# EAGLE schematic Shutdown_2019_v1.0 (EAGLE 9.1.2)

## Sheet 1 of 10: uController
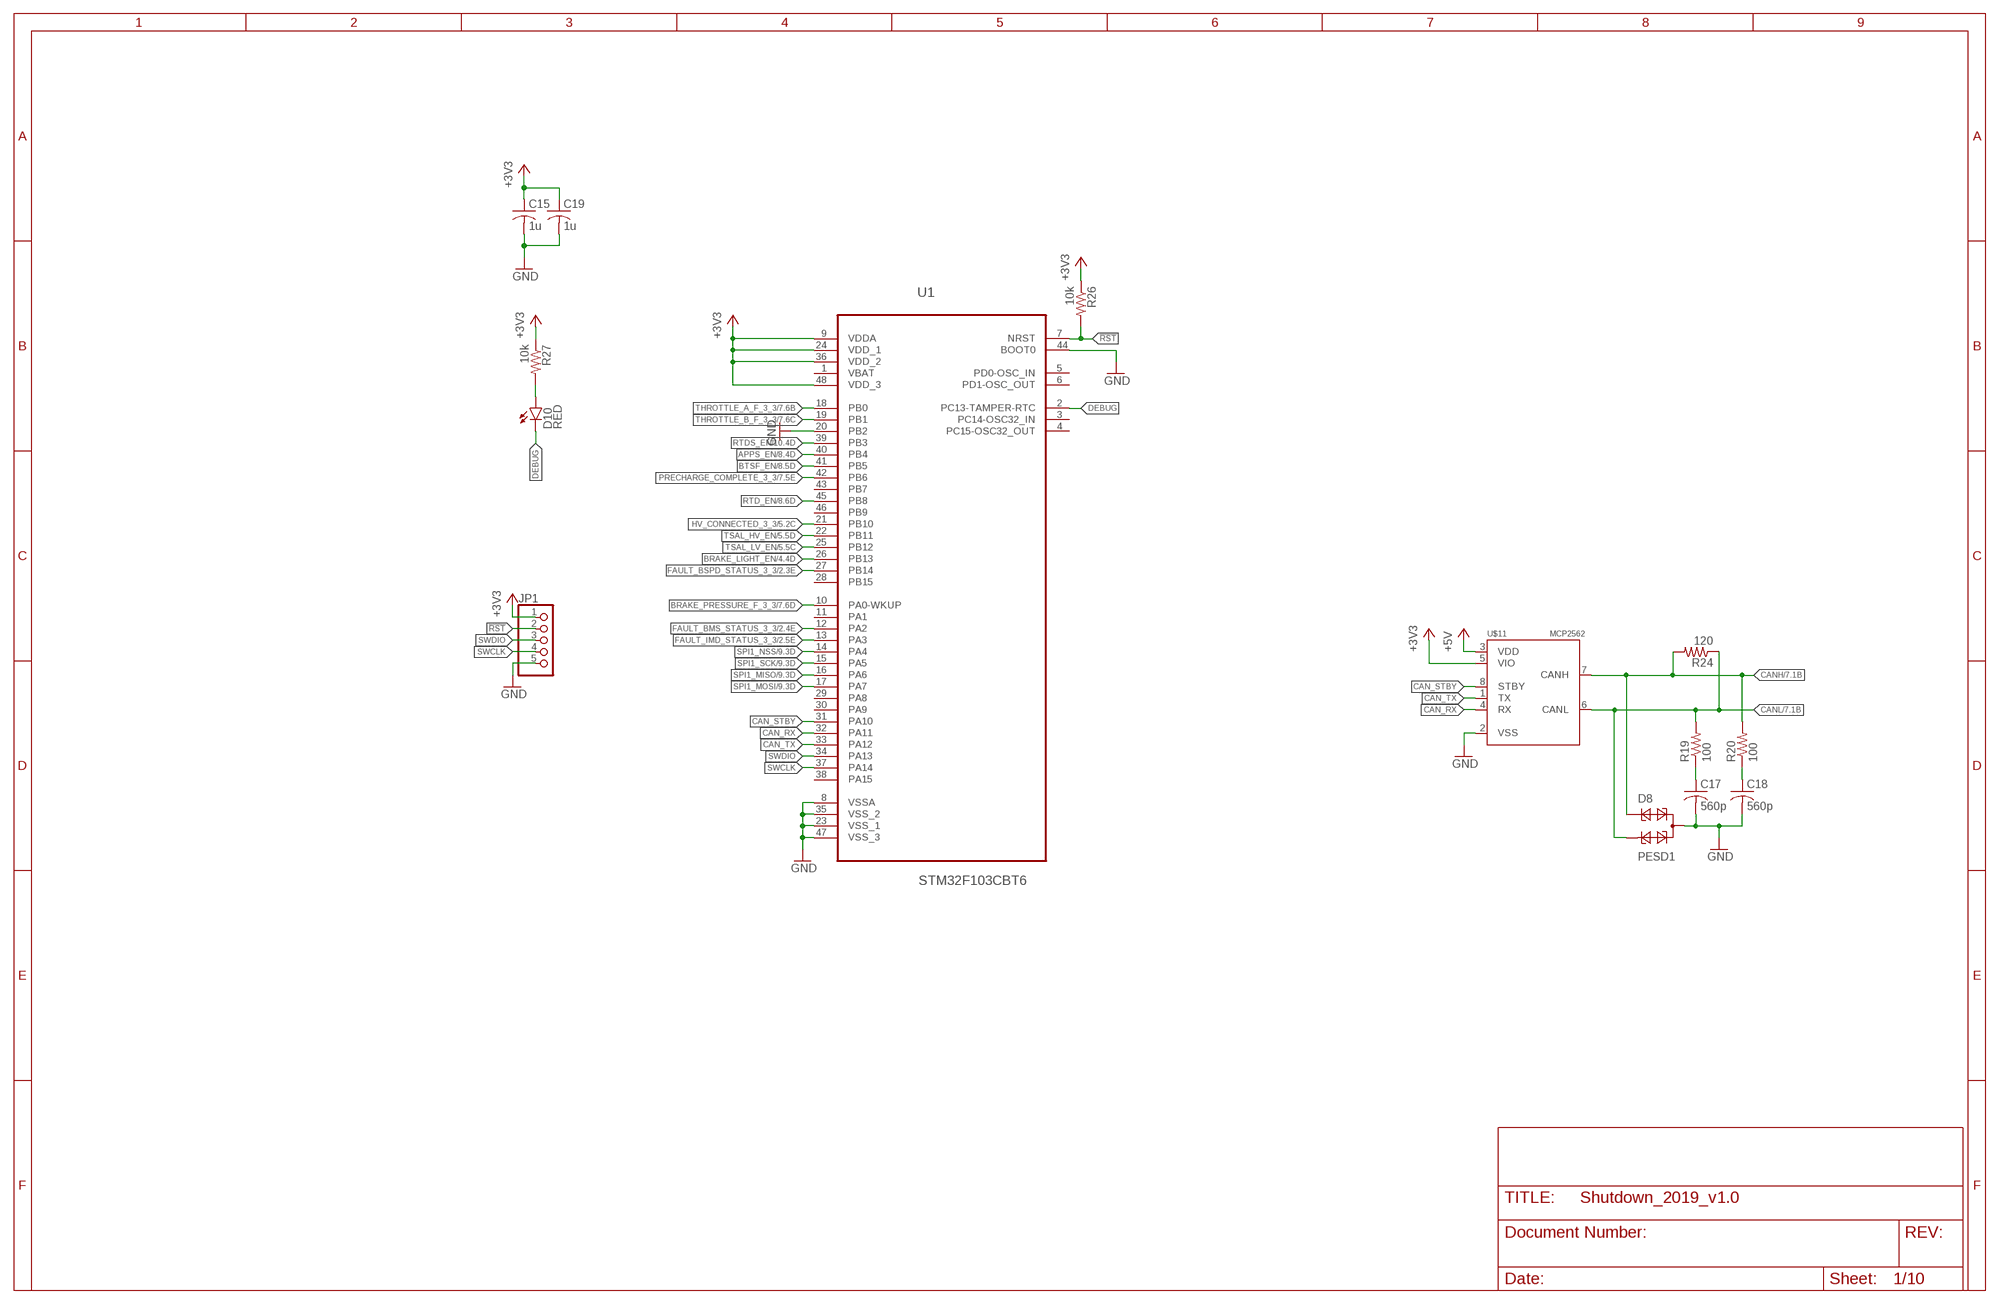
[diagram p0: schematic, sheet 1]

### Parts
C15  1u  C-USC0805  [C0805]
C17  560p  C-USC0603  [C0603]
C18  560p  C-USC0603  [C0603]
C19  1u  C-USC0805  [C0805]
D8  PESD1  PESD1CAN  [SOT23]
D10  RED  LED-RED0603  [LED-0603]
JP1  PINHD-1X5  [1X05]
R19  100  R-US_R0603  [R0603]
R20  100  R-US_R0603  [R0603]
R24  120  R-US_R0603  [R0603]
R26  10k  R-US_R0603  [R0603]
R27  10k  R-US_R0603  [R0603]
U1  STM32F103CBT6  [QFP50P900X900X160-48N]
U$11  MCP2562  [SOIC8]

### Nets
!RST: JP1.2 R26.2 U1.7(NRST)
+3V3 [PWR]: C15.1 C19.1 JP1.1 R26.1 R27.1 U1.9(VDDA) U1.24(VDD_1) U1.36(VDD_2) U1.48(VDD_3) U$11.5(VIO) ; also sheet 2,5,6,7,9
+5V [PWR]: U$11.3(VDD) ; also sheet 3,6,7,9
APPS_EN: U1.40(PB4) ; also sheet 8
BRAKE_LIGHT_EN: U1.26(PB13) ; also sheet 4
BRAKE_PRESSURE_F_3_3: U1.10(PA0-WKUP) ; also sheet 7
BTSF_EN: U1.41(PB5) ; also sheet 8
CAN_RX: U1.32(PA11) U$11.4(RX)
CAN_STBY: U1.31(PA10) U$11.8(STBY)
CAN_TX: U1.33(PA12) U$11.1(TX)
CANH: D8.1 R20.2 R24.2 U$11.7(CANH) ; also sheet 7
CANL: D8.2 R19.2 R24.1 U$11.6(CANL) ; also sheet 7
DEBUG: D10.C U1.2(PC13-TAMPER-RTC)
FAULT_BMS_STATUS_3_3: U1.12(PA2) ; also sheet 2
FAULT_BSPD_STATUS_3_3: U1.27(PB14) ; also sheet 2
FAULT_IMD_STATUS_3_3: U1.13(PA3) ; also sheet 2
GND: C15.2 C17.2 C18.2 C19.2 D8.3 JP1.5 U1.8(VSSA) U1.20(PB2) U1.23(VSS_1) U1.35(VSS_2) U1.44(BOOT0) U1.47(VSS_3) U$11.2(VSS) ; also sheet 2,3,4,5,6,7,8,9,10
HV_CONNECTED_3_3: U1.21(PB10) ; also sheet 5
N$14: C17.1 R19.1
N$17: C18.1 R20.1
N$19: D10.A R27.2
PRECHARGE_COMPLETE_3_3: U1.42(PB6) ; also sheet 7
RTD_EN: U1.45(PB8) ; also sheet 8
RTDS_EN: U1.39(PB3) ; also sheet 10
SPI1_MISO: U1.16(PA6) ; also sheet 9
SPI1_MOSI: U1.17(PA7) ; also sheet 9
SPI1_NSS: U1.14(PA4) ; also sheet 9
SPI1_SCK: U1.15(PA5) ; also sheet 9
SWCLK: JP1.4 U1.37(PA14)
SWDIO: JP1.3 U1.34(PA13)
THROTTLE_A_F_3_3: U1.18(PB0) ; also sheet 7
THROTTLE_B_F_3_3: U1.19(PB1) ; also sheet 7
TSAL_HV_EN: U1.22(PB11) ; also sheet 5
TSAL_LV_EN: U1.25(PB12) ; also sheet 5
Unconnected: U1.1(VBAT) U1.3(PC14-OSC32_IN) U1.4(PC15-OSC32_OUT) U1.5(PD0-OSC_IN) U1.6(PD1-OSC_OUT) U1.11(PA1) U1.28(PB15) U1.29(PA8) U1.30(PA9) U1.38(PA15) U1.43(PB7) U1.46(PB9)

## Sheet 2 of 10: Faults
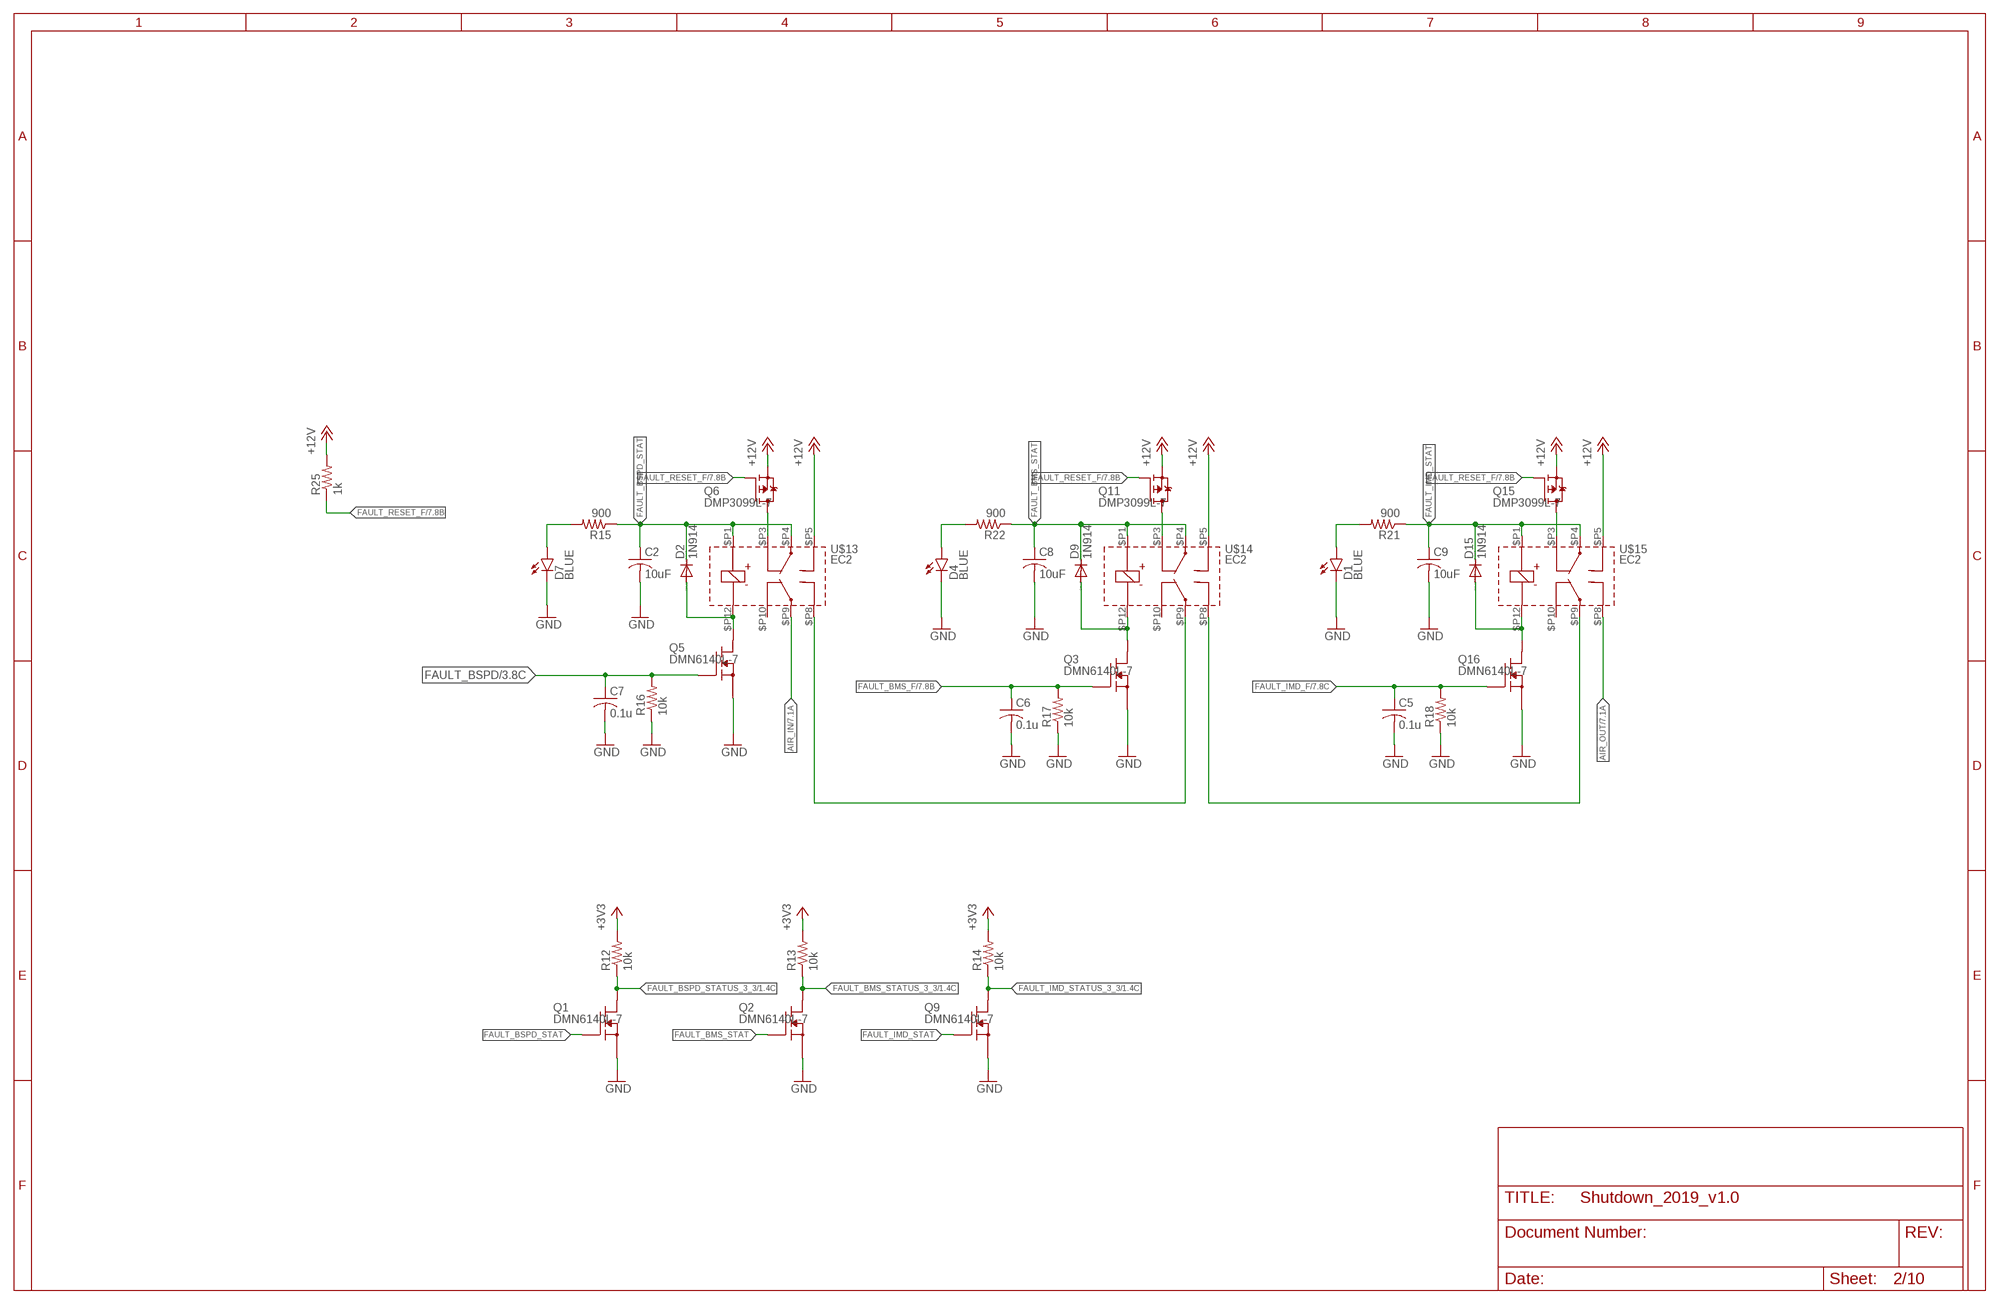
[diagram p1: schematic, sheet 2]

### Parts
C2  10uF  C-USC0805  [C0805]
C5  0.1u  C-USC0603  [C0603]
C6  0.1u  C-USC0603  [C0603]
C7  0.1u  C-USC0603  [C0603]
C8  10uF  C-USC0805  [C0805]
C9  10uF  C-USC0805  [C0805]
D1  BLUE  LED-BLUE0603  [LED-0603]
D2  1N914  [SOD323-F]
D4  BLUE  LED-BLUE0603  [LED-0603]
D7  BLUE  LED-BLUE0603  [LED-0603]
D9  1N914  [SOD323-F]
D15  1N914  [SOD323-F]
Q1  DMN6140L-7  [SOT23]
Q2  DMN6140L-7  [SOT23]
Q3  DMN6140L-7  [SOT23]
Q5  DMN6140L-7  [SOT23]
Q6  DMP3099L-7  [SOT23]
Q9  DMN6140L-7  [SOT23]
Q11  DMP3099L-7  [SOT23]
Q15  DMP3099L-7  [SOT23]
Q16  DMN6140L-7  [SOT23]
R12  10k  R-US_R0603  [R0603]
R13  10k  R-US_R0603  [R0603]
R14  10k  R-US_R0603  [R0603]
R15  900  R-US_R0603  [R0603]
R16  10k  R-US_R0603  [R0603]
R17  10k  R-US_R0603  [R0603]
R18  10k  R-US_R0603  [R0603]
R21  900  R-US_R0603  [R0603]
R22  900  R-US_R0603  [R0603]
R25  1k  R-US_R0603  [R0603]
U$13  EC2  [DPDT_2.54]
U$14  EC2  [DPDT_2.54]
U$15  EC2  [DPDT_2.54]

### Nets
+3V3 [PWR]: R12.2 R13.2 R14.2 ; also sheet 1,5,6,7,9
+12V [PWR_IN]: Q6.2(S) Q11.2(S) Q15.2(S) R25.2 U$13.$P5 U$14.$P5 U$15.$P5 ; also sheet 3,6
AIR_IN: U$13.$P9 ; also sheet 7
AIR_OUT: U$15.$P8 ; also sheet 7
FAULT_BMS_F: C6.1 Q3.1(G) R17.2 ; also sheet 7
FAULT_BMS_STAT: C8.1 D9.C Q2.1(G) R22.1 U$14.$P1 U$14.$P4
FAULT_BMS_STATUS_3_3: Q2.3(D) R13.1 ; also sheet 1
FAULT_BSPD: C7.1 Q5.1(G) R16.2 ; also sheet 3
FAULT_BSPD_STAT: C2.1 D2.C Q1.1(G) R15.1 U$13.$P1 U$13.$P4
FAULT_BSPD_STATUS_3_3: Q1.3(D) R12.1 ; also sheet 1
FAULT_IMD_F: C5.1 Q16.1(G) R18.2 ; also sheet 7
FAULT_IMD_STAT: C9.1 D15.C Q9.1(G) R21.1 U$15.$P1 U$15.$P4
FAULT_IMD_STATUS_3_3: Q9.3(D) R14.1 ; also sheet 1
FAULT_RESET_F: Q6.1(G) Q11.1(G) Q15.1(G) R25.1 ; also sheet 7
GND: C2.2 C5.2 C6.2 C7.2 C8.2 C9.2 D1.C D4.C D7.C Q1.2(S) Q2.2(S) Q3.2(S) Q5.2(S) Q9.2(S) Q16.2(S) R16.1 R17.1 R18.1 ; also sheet 1,3,4,5,6,7,8,9,10
N$1: D9.A Q3.3(D) U$14.$P12
N$8: D7.A R15.2
N$27: U$13.$P8 U$14.$P9
N$28: Q6.3(D) U$13.$P3
N$31: U$14.$P8 U$15.$P9
N$32: D2.A Q5.3(D) U$13.$P12
N$34: D4.A R22.2
N$35: Q11.3(D) U$14.$P3
N$42: D1.A R21.2
N$43: Q15.3(D) U$15.$P3
N$44: D15.A Q16.3(D) U$15.$P12
Unconnected: U$13.$P10 U$14.$P10 U$15.$P10

## Sheet 3 of 10: BSPD
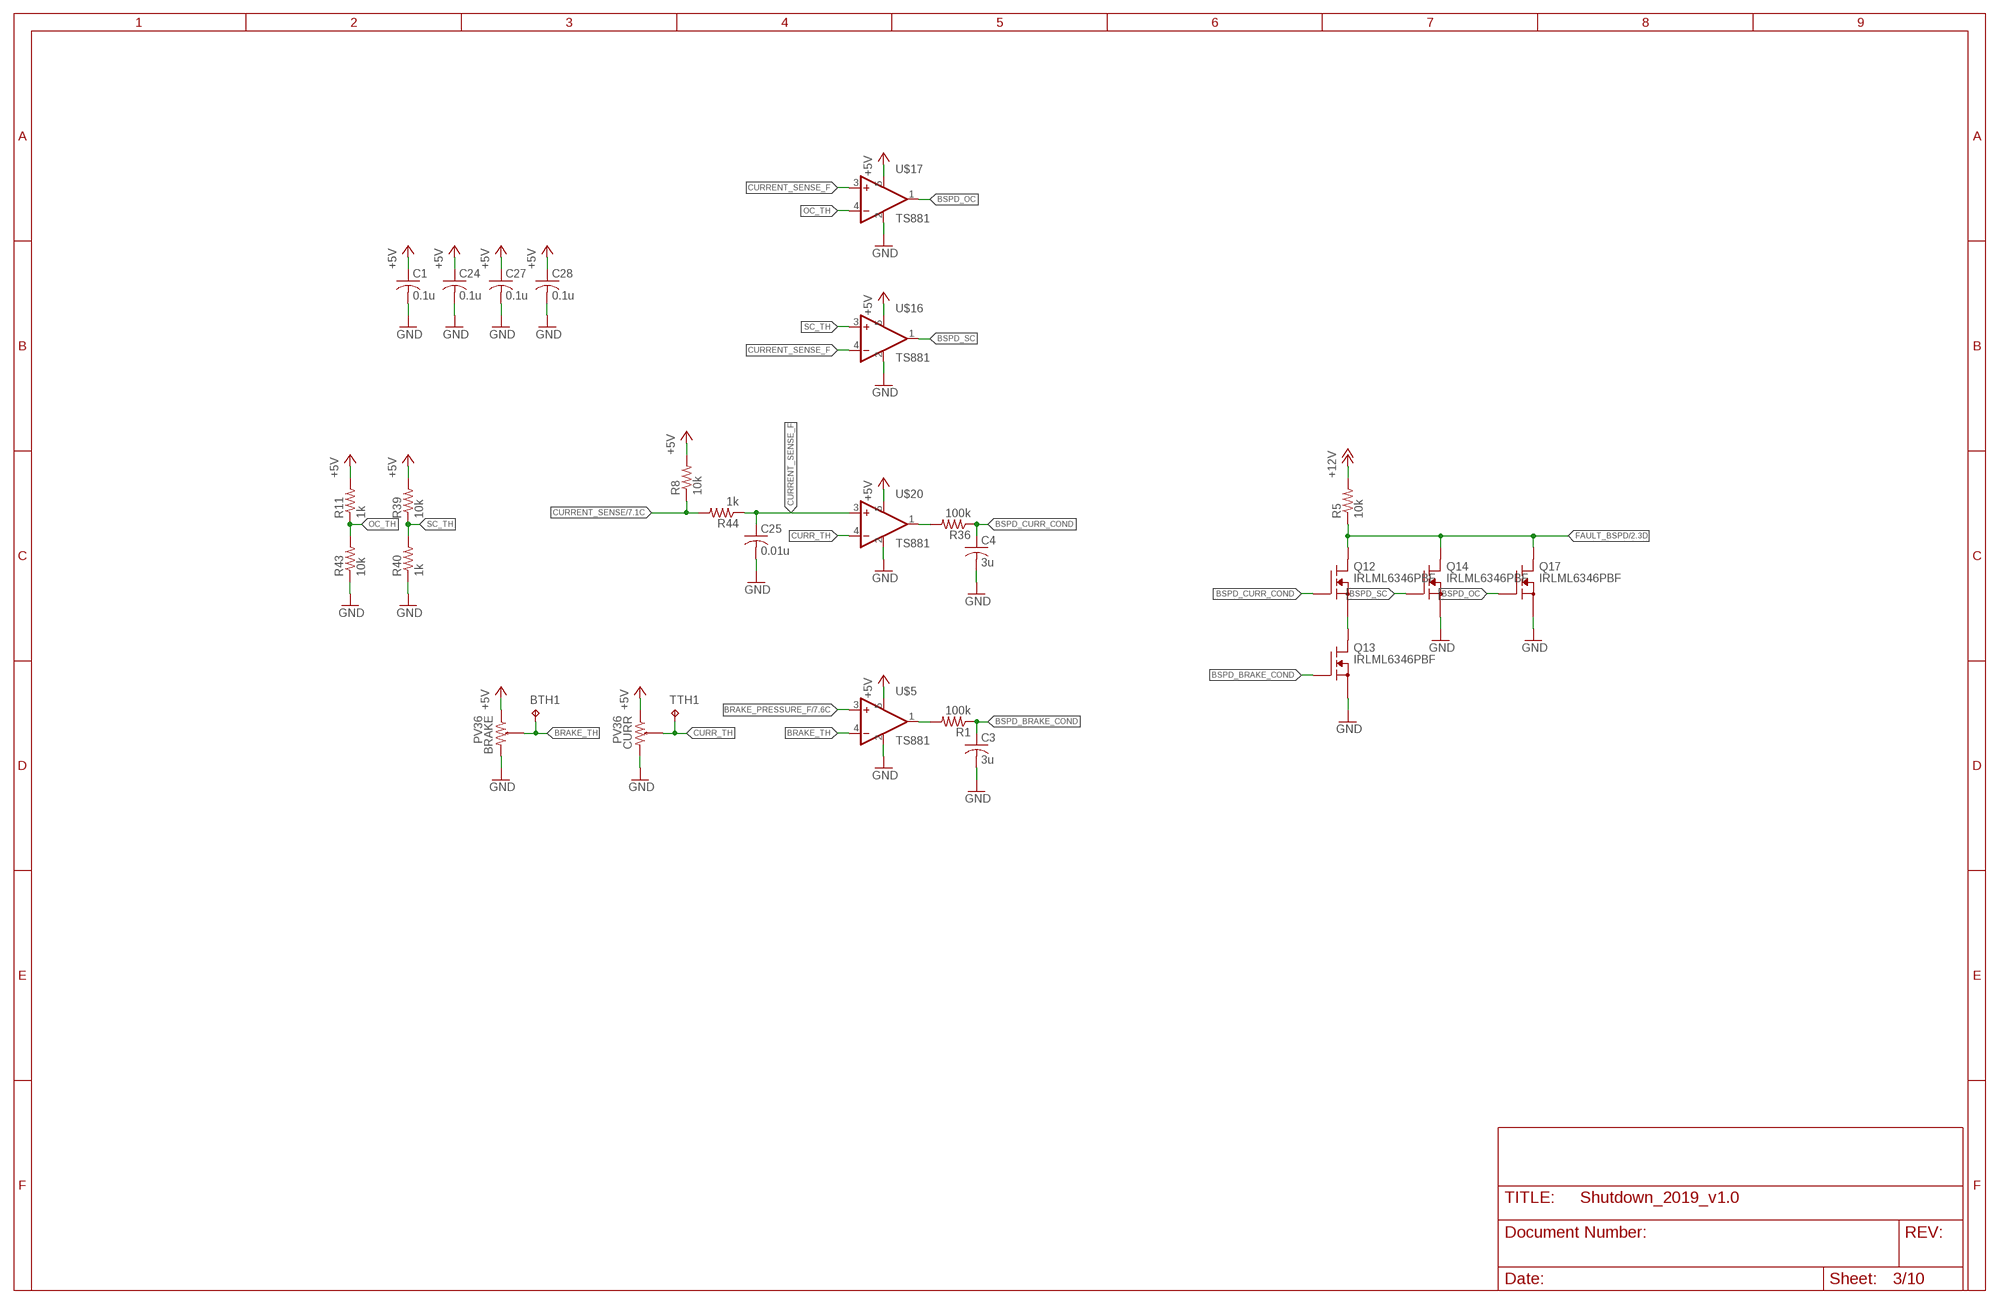
[diagram p2: schematic, sheet 3]

### Parts
BRAKE  PV36  [PV36]
BTH1  TPTP09R  [TP09R]
C1  0.1u  C-USC0603  [C0603]
C3  3u  C-USC0603  [C0603]
C4  3u  C-USC0603  [C0603]
C24  0.1u  C-USC0603  [C0603]
C25  0.01u  C-USC0603  [C0603]
C27  0.1u  C-USC0603  [C0603]
C28  0.1u  C-USC0603  [C0603]
CURR  PV36  [PV36]
Q12  IRLML6346PBF  [SOT23]
Q13  IRLML6346PBF  [SOT23]
Q14  IRLML6346PBF  [SOT23]
Q17  IRLML6346PBF  [SOT23]
R1  100k  R-US_R0603  [R0603]
R5  10k  R-US_R0603  [R0603]
R8  10k  R-US_R0603  [R0603]
R11  1k  R-US_R0603  [R0603]
R36  100k  R-US_R0603  [R0603]
R39  10k  R-US_R0603  [R0603]
R40  1k  R-US_R0603  [R0603]
R43  10k  R-US_R0603  [R0603]
R44  1k  R-US_R0603  [R0603]
TTH1  TPTP09R  [TP09R]
U$5  TS881  [SOT23-5]
U$16  TS881  [SOT23-5]
U$17  TS881  [SOT23-5]
U$20  TS881  [SOT23-5]

### Nets
+5V [PWR]: BRAKE.A C1.1 C24.1 C27.1 C28.1 CURR.A R8.2 R11.2 R39.2 U$5.5(VDD) U$16.5(VDD) U$17.5(VDD) U$20.5(VDD) ; also sheet 1,6,7,9
+12V [PWR_IN]: R5.2 ; also sheet 2,6
BRAKE_PRESSURE_F: U$5.3(+IN) ; also sheet 7
BRAKE_TH: BRAKE.W BTH1.TP U$5.4(-IN)
BSPD_BRAKE_COND: C3.1 Q13.1(G) R1.1
BSPD_CURR_COND: C4.1 Q12.1(G) R36.1
BSPD_OC: Q17.1(G) U$17.1(OUT)
BSPD_SC: Q14.1(G) U$16.1(OUT)
CURR_TH: CURR.W TTH1.TP U$20.4(-IN)
CURRENT_SENSE: R8.1 R44.2 ; also sheet 7
CURRENT_SENSE_F: C25.1 R44.1 U$16.4(-IN) U$17.3(+IN) U$20.3(+IN)
FAULT_BSPD: Q12.3(D) Q14.3(D) Q17.3(D) R5.1 ; also sheet 2
GND: BRAKE.B C1.2 C3.2 C4.2 C24.2 C25.2 C27.2 C28.2 CURR.B Q13.2(S) Q14.2(S) Q17.2(S) R40.1 R43.1 U$5.2(GND) U$16.2(GND) U$17.2(GND) U$20.2(GND) ; also sheet 1,2,4,5,6,7,8,9,10
N$9: Q12.2(S) Q13.3(D)
N$13: R36.2 U$20.1(OUT)
N$18: R1.2 U$5.1(OUT)
OC_TH: R11.1 R43.2 U$17.4(-IN)
SC_TH: R39.1 R40.2 U$16.3(+IN)

## Sheet 4 of 10: Brake Light
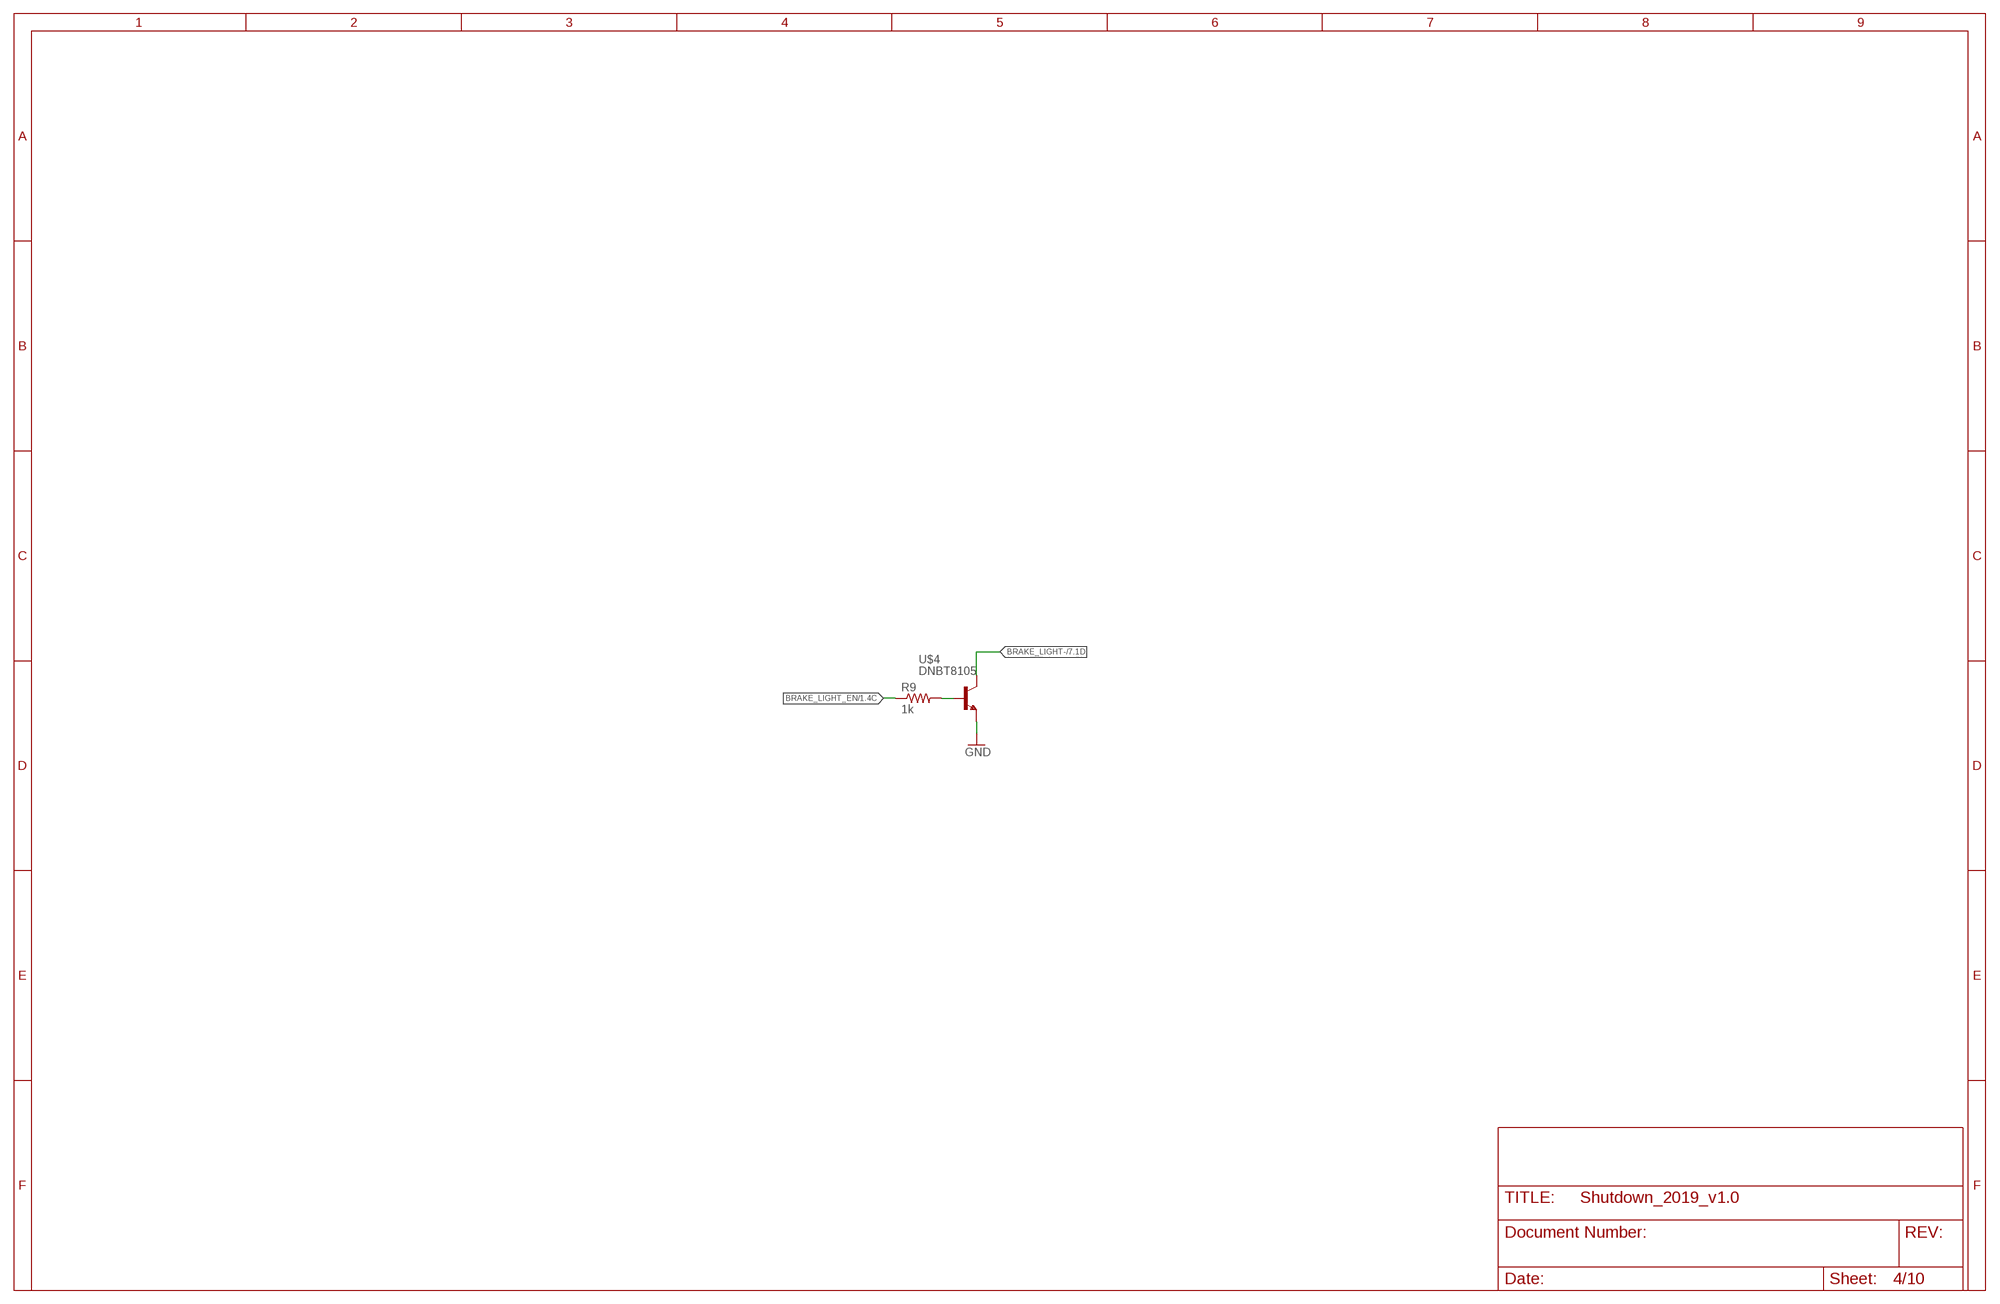
[diagram p3: schematic, sheet 4]

### Parts
R9  1k  R-US_R0603  [R0603]
U$4  DNBT8105  [SOT23-3]

### Nets
BRAKE_LIGHT-: U$4.3(C) ; also sheet 7
BRAKE_LIGHT_EN: R9.1 ; also sheet 1
GND: U$4.2(E) ; also sheet 1,2,3,5,6,7,8,9,10
N$3: R9.2 U$4.1(B)

## Sheet 5 of 10: TSAL
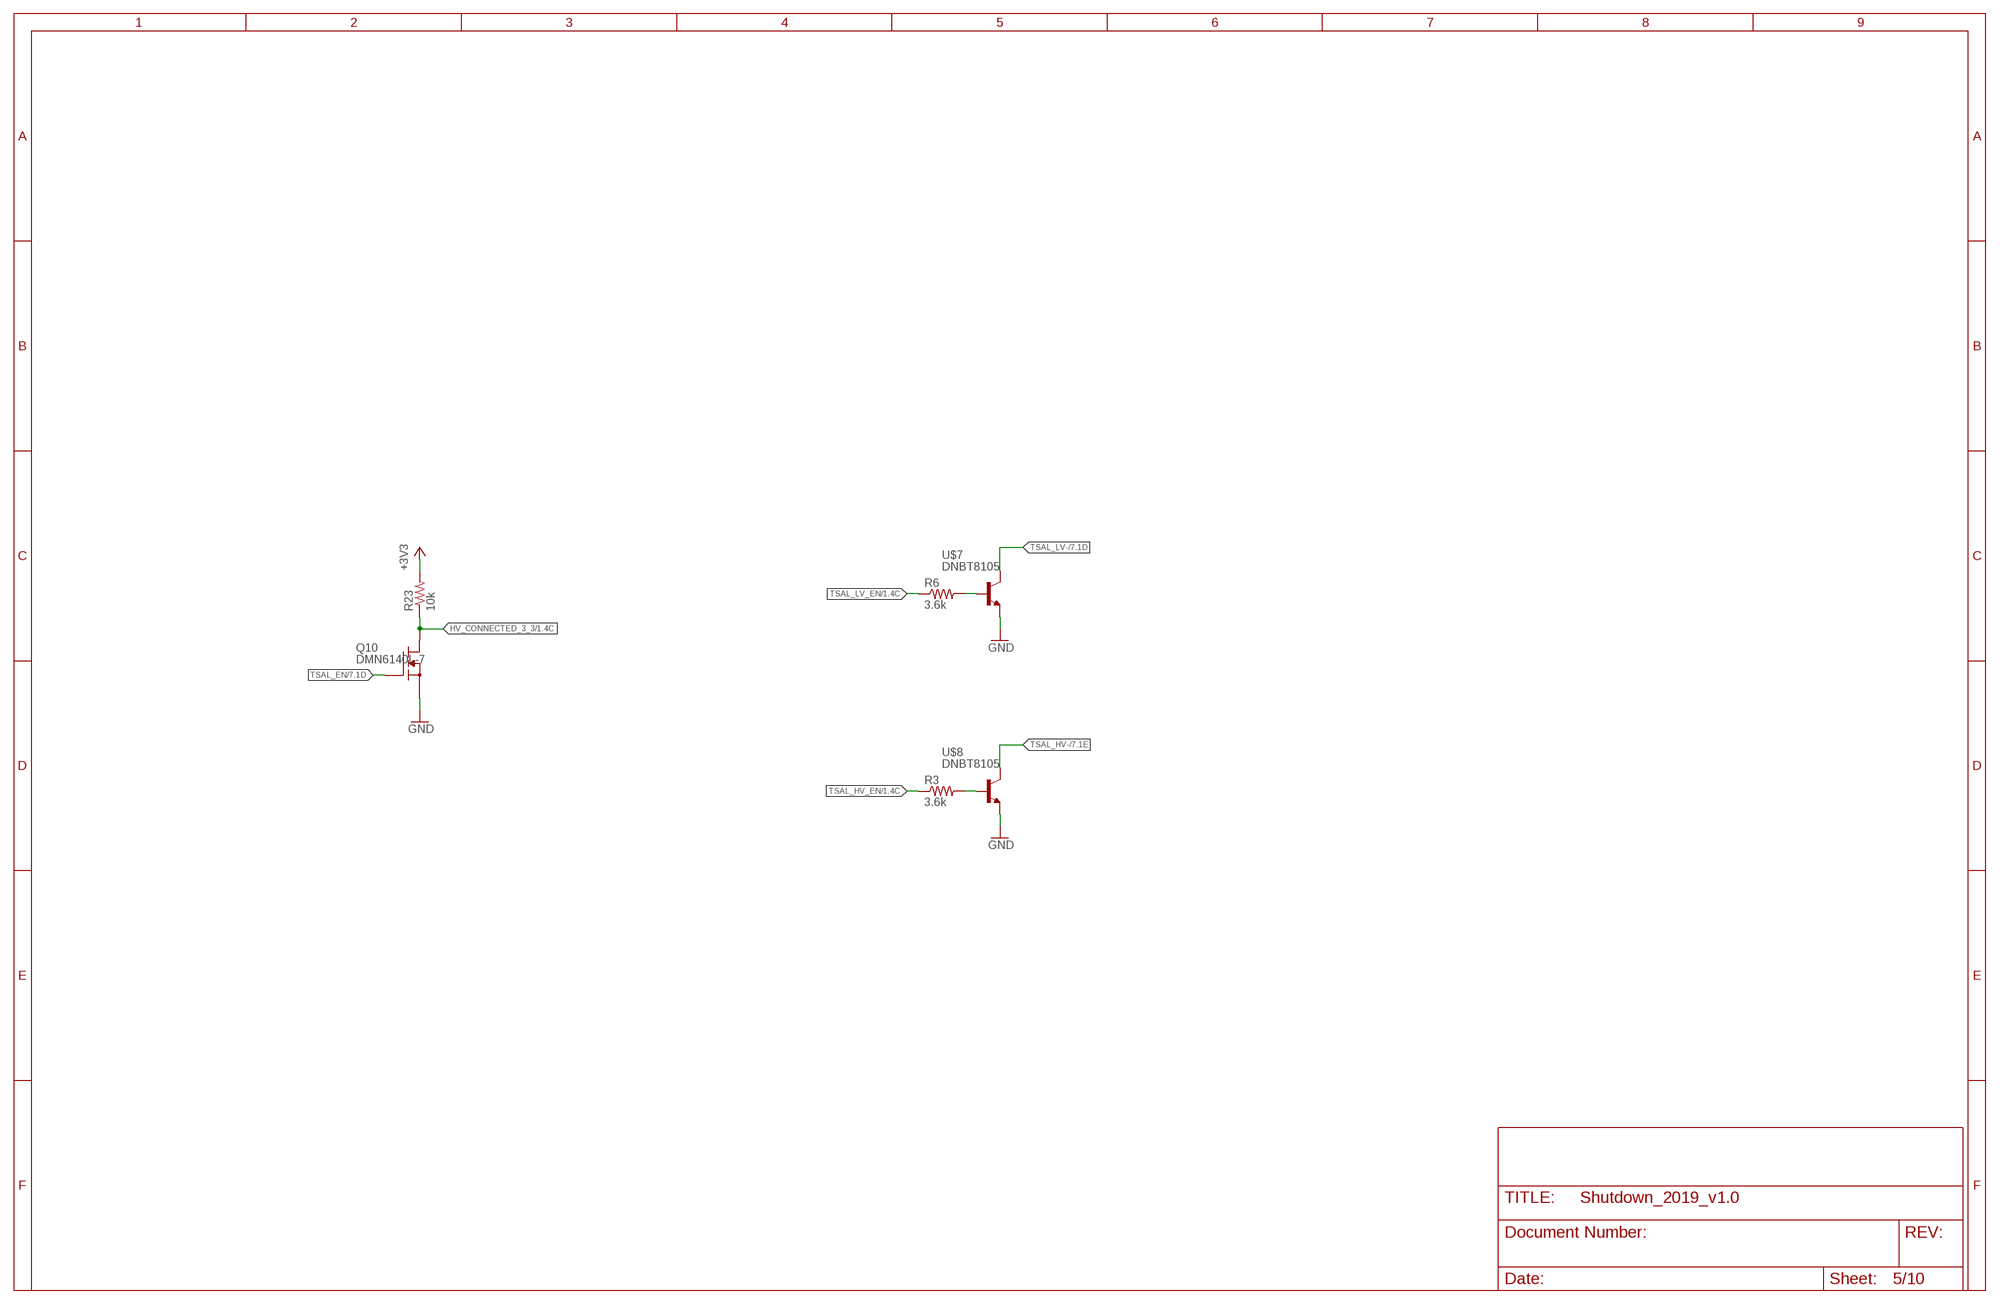
[diagram p4: schematic, sheet 5]

### Parts
Q10  DMN6140L-7  [SOT23]
R3  3.6k  R-US_R0603  [R0603]
R6  3.6k  R-US_R0603  [R0603]
R23  10k  R-US_R0603  [R0603]
U$7  DNBT8105  [SOT23-3]
U$8  DNBT8105  [SOT23-3]

### Nets
+3V3 [PWR]: R23.2 ; also sheet 1,2,6,7,9
GND: Q10.2(S) U$7.2(E) U$8.2(E) ; also sheet 1,2,3,4,6,7,8,9,10
HV_CONNECTED_3_3: Q10.3(D) R23.1 ; also sheet 1
N$15: R3.2 U$8.1(B)
N$16: R6.2 U$7.1(B)
TSAL_EN: Q10.1(G) ; also sheet 7
TSAL_HV-: U$8.3(C) ; also sheet 7
TSAL_HV_EN: R3.1 ; also sheet 1
TSAL_LV-: U$7.3(C) ; also sheet 7
TSAL_LV_EN: R6.1 ; also sheet 1

## Sheet 6 of 10: Power ICs
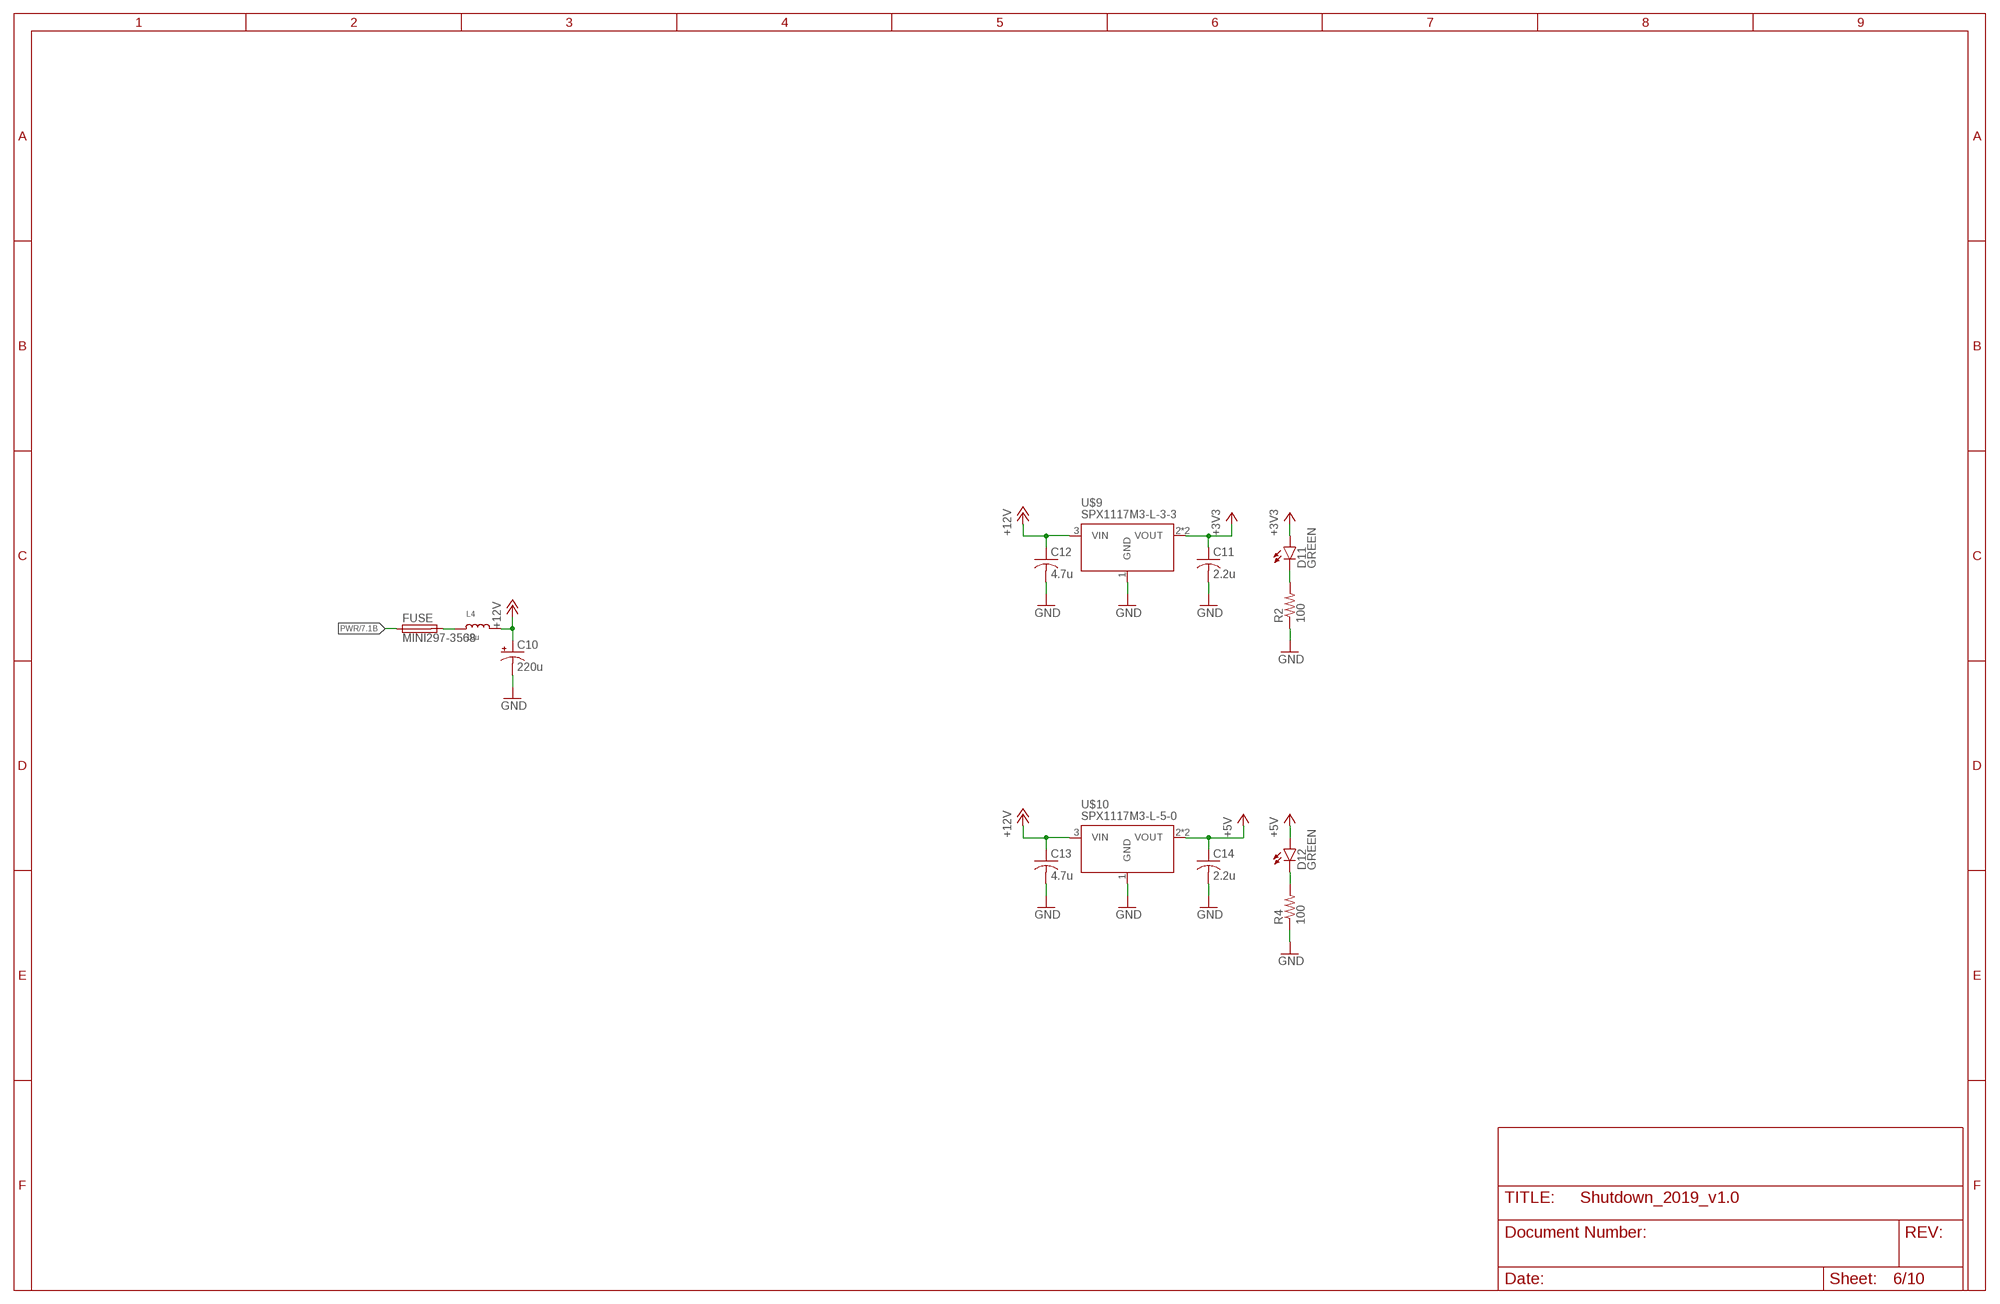
[diagram p5: schematic, sheet 6]

### Parts
C10  220u  CPOL-USE2.5-7  [E2,5-7]
C11  2.2u  C-USC0805  [C0805]
C12  4.7u  C-USC0805  [C0805]
C13  4.7u  C-USC0805  [C0805]
C14  2.2u  C-USC0805  [C0805]
D11  GREEN  LED-GREEN0603  [LED-0603]
D12  GREEN  LED-GREEN0603  [LED-0603]
FUSE  MINI297-3568  [3568]
L4  10u  INDUCTORNR5040  [INDUCTOR_5X5MM_NR5040_NOTHERMALS]
R2  100  R-US_R0603  [R0603]
R4  100  R-US_R0603  [R0603]
U$9  SPX1117M3-L-3-3  [SOT223]
U$10  SPX1117M3-L-5-0  [SOT223]

### Nets
+3V3 [PWR]: C11.1 D11.A U$9.2(VOUT) U$9.4(VOUT) ; also sheet 1,2,5,7,9
+5V [PWR]: C14.1 D12.A U$10.2(VOUT) U$10.4(VOUT) ; also sheet 1,3,7,9
+12V [PWR_IN]: C10.+ C12.1 C13.1 L4.P$2 U$9.3(VIN) U$10.3(VIN) ; also sheet 2,3
GND: C10.- C11.2 C12.2 C13.2 C14.2 R2.1 R4.1 U$9.1(GND) U$10.1(GND) ; also sheet 1,2,3,4,5,7,8,9,10
N$6 [PWR_IN]: FUSE.P$2 FUSE.P$3 L4.P$1
N$10: D12.C R4.2
N$11: D11.C R2.2
PWR [PWR_IN]: FUSE.P$1 FUSE.P$4 ; also sheet 7

## Sheet 7 of 10: Connector
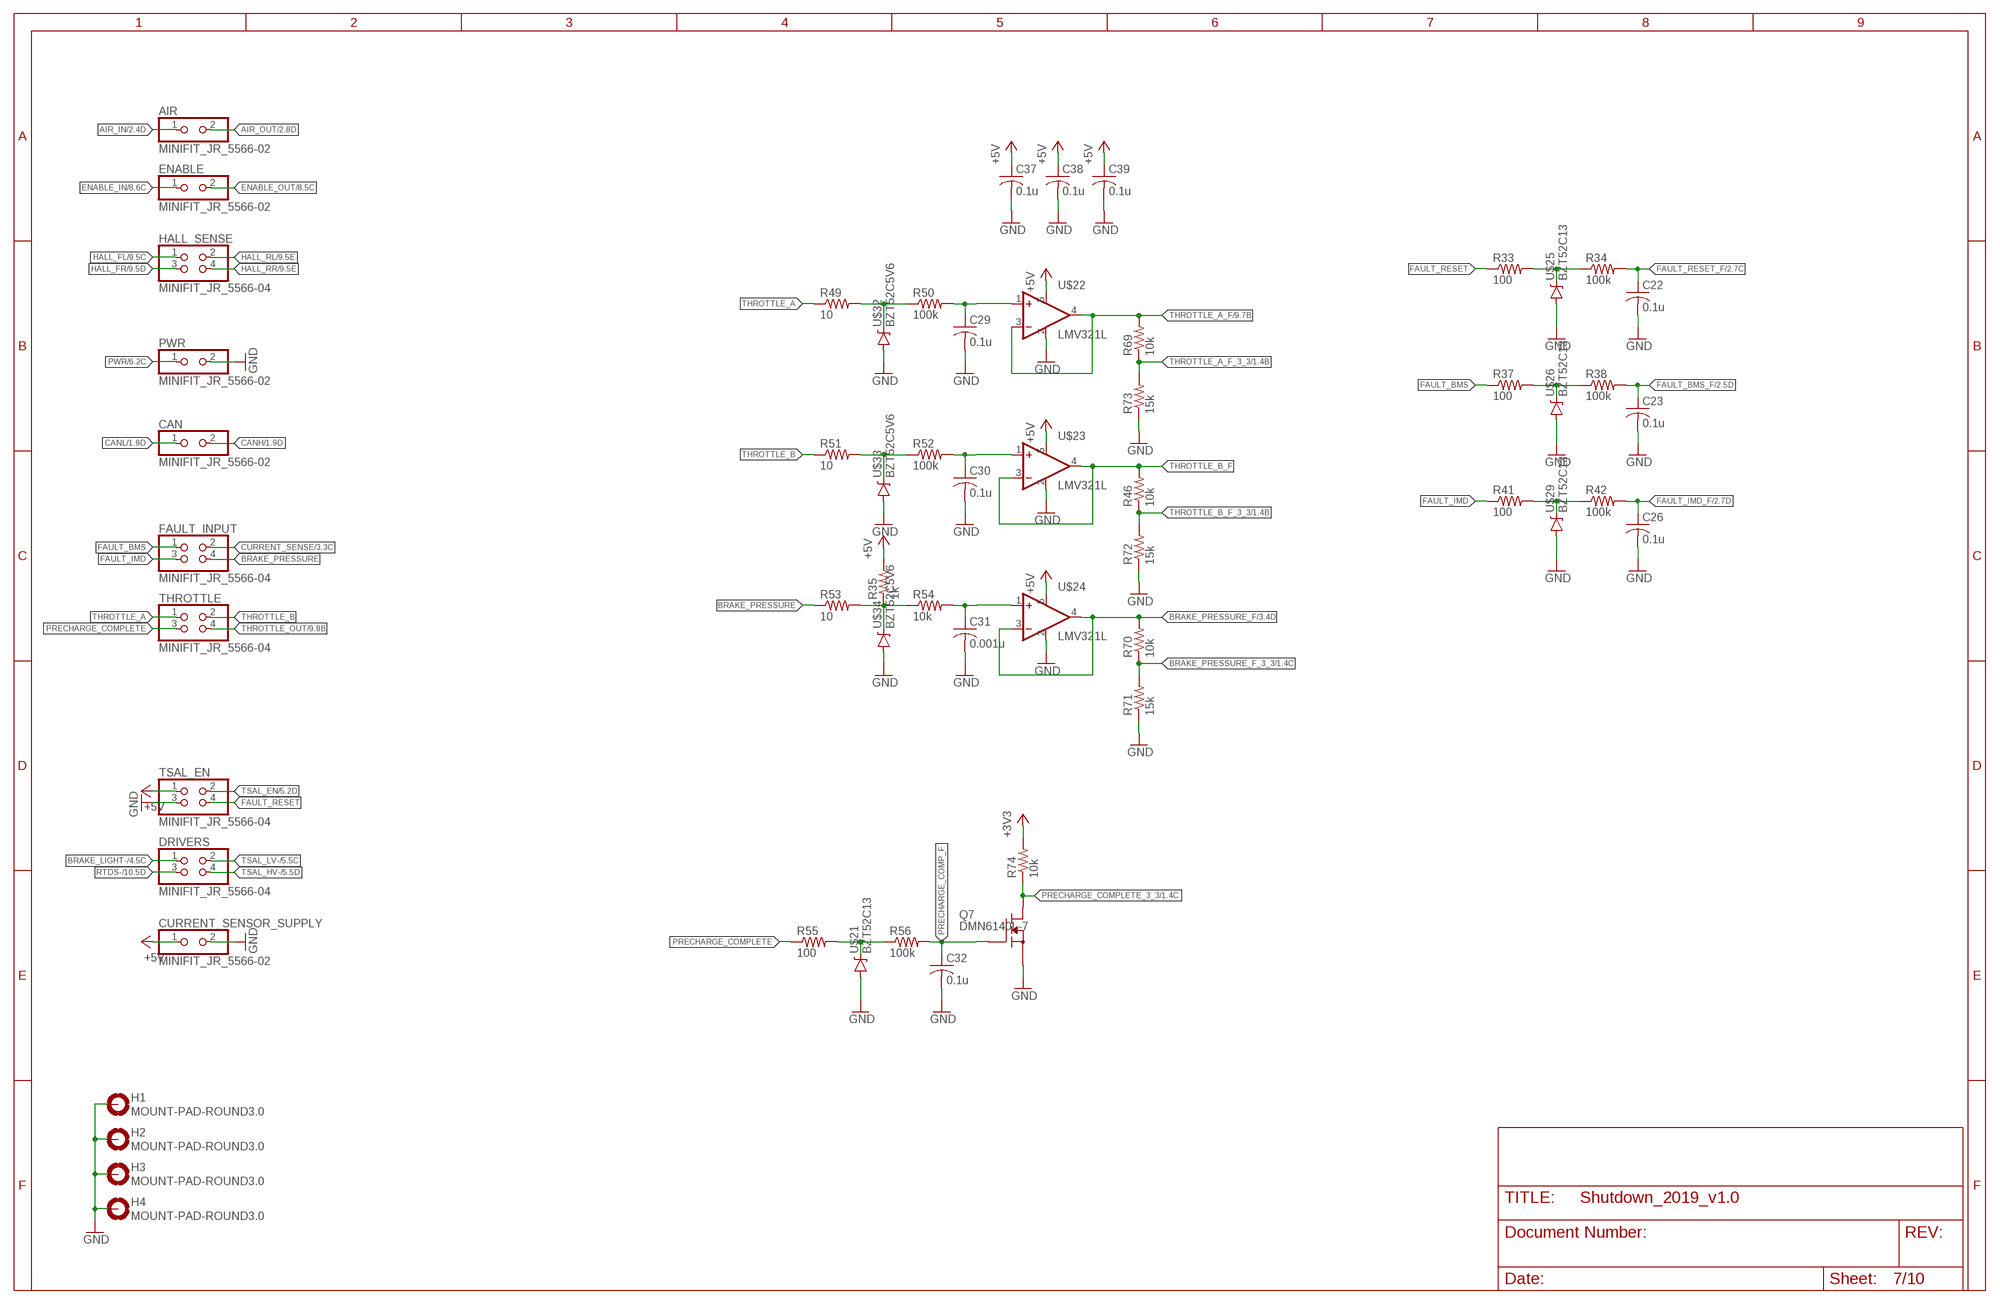
[diagram p6: schematic, sheet 7]

### Parts
AIR  MINIFIT_JR_5566-02  [MINIFIT_JR_5566-02]
C22  0.1u  C-USC0805  [C0805]
C23  0.1u  C-USC0805  [C0805]
C26  0.1u  C-USC0805  [C0805]
C29  0.1u  C-USC0805  [C0805]
C30  0.1u  C-USC0805  [C0805]
C31  0.001u  C-USC0805  [C0805]
C32  0.1u  C-USC0805  [C0805]
C37  0.1u  C-USC0603  [C0603]
C38  0.1u  C-USC0603  [C0603]
C39  0.1u  C-USC0603  [C0603]
CAN  MINIFIT_JR_5566-02  [MINIFIT_JR_5566-02]
CURRENT_SENSOR_SUPPLY  MINIFIT_JR_5566-02  [MINIFIT_JR_5566-02]
DRIVERS  MINIFIT_JR_5566-04  [MINIFIT_JR_5566-04]
ENABLE  MINIFIT_JR_5566-02  [MINIFIT_JR_5566-02]
FAULT_INPUT  MINIFIT_JR_5566-04  [MINIFIT_JR_5566-04]
H1  MOUNT-PAD-ROUND3.0  [3,0-PAD]
H2  MOUNT-PAD-ROUND3.0  [3,0-PAD]
H3  MOUNT-PAD-ROUND3.0  [3,0-PAD]
H4  MOUNT-PAD-ROUND3.0  [3,0-PAD]
HALL_SENSE  MINIFIT_JR_5566-04  [MINIFIT_JR_5566-04]
PWR  MINIFIT_JR_5566-02  [MINIFIT_JR_5566-02]
Q7  DMN6140L-7  [SOT23]
R33  100  R-US_R0603  [R0603]
R34  100k  R-US_R0603  [R0603]
R35  1k  R-US_R0603  [R0603]
R37  100  R-US_R0603  [R0603]
R38  100k  R-US_R0603  [R0603]
R41  100  R-US_R0603  [R0603]
R42  100k  R-US_R0603  [R0603]
R46  10k  R-US_R0603  [R0603]
R49  10  R-US_R0603  [R0603]
R50  100k  R-US_R0603  [R0603]
R51  10  R-US_R0603  [R0603]
R52  100k  R-US_R0603  [R0603]
R53  10  R-US_R0603  [R0603]
R54  10k  R-US_R0603  [R0603]
R55  100  R-US_R0603  [R0603]
R56  100k  R-US_R0603  [R0603]
R69  10k  R-US_R0603  [R0603]
R70  10k  R-US_R0603  [R0603]
R71  15k  R-US_R0603  [R0603]
R72  15k  R-US_R0603  [R0603]
R73  15k  R-US_R0603  [R0603]
R74  10k  R-US_R0603  [R0603]
THROTTLE  MINIFIT_JR_5566-04  [MINIFIT_JR_5566-04]
TSAL_EN  MINIFIT_JR_5566-04  [MINIFIT_JR_5566-04]
U$21  BZT52C13  BZT52C  [SOD-123]
U$22  LMV321L  [SOT23-5]
U$23  LMV321L  [SOT23-5]
U$24  LMV321L  [SOT23-5]
U$25  BZT52C13  BZT52C  [SOD-123]
U$26  BZT52C13  BZT52C  [SOD-123]
U$29  BZT52C13  BZT52C  [SOD-123]
U$32  BZT52C5V6  BZT52C  [SOD-123]
U$33  BZT52C5V6  BZT52C  [SOD-123]
U$34  BZT52C5V6  BZT52C  [SOD-123]

### Nets
+3V3 [PWR]: R74.2 ; also sheet 1,2,5,6,9
+5V [PWR]: C37.1 C38.1 C39.1 CURRENT_SENSOR_SUPPLY.1 R35.2 TSAL_EN.1 U$22.5(VDD) U$23.5(VDD) U$24.5(VDD) ; also sheet 1,3,6,9
AIR_IN: AIR.1 ; also sheet 2
AIR_OUT: AIR.2 ; also sheet 2
BRAKE_LIGHT-: DRIVERS.1 ; also sheet 4
BRAKE_PRESSURE: FAULT_INPUT.4 R53.1
BRAKE_PRESSURE_F: R70.2 U$24.3(-IN) U$24.4(OUT) ; also sheet 3
BRAKE_PRESSURE_F_3_3: R70.1 R71.2 ; also sheet 1
CANH: CAN.2 ; also sheet 1
CANL: CAN.1 ; also sheet 1
CURRENT_SENSE: FAULT_INPUT.2 ; also sheet 3
ENABLE_IN: ENABLE.1 ; also sheet 8
ENABLE_OUT: ENABLE.2 ; also sheet 8
FAULT_BMS: FAULT_INPUT.1 R37.1
FAULT_BMS_F: C23.1 R38.2 ; also sheet 2
FAULT_IMD: FAULT_INPUT.3 R41.1
FAULT_IMD_F: C26.1 R42.2 ; also sheet 2
FAULT_RESET: R33.1 TSAL_EN.4
FAULT_RESET_F: C22.1 R34.2 ; also sheet 2
GND: C22.2 C23.2 C26.2 C29.2 C30.2 C31.2 C32.2 C37.2 C38.2 C39.2 CURRENT_SENSOR_SUPPLY.2 H1.B3,0(MOUNT) H2.B3,0(MOUNT) H3.B3,0(MOUNT) H4.B3,0(MOUNT) PWR.2 Q7.2(S) R71.1 R72.1 R73.1 TSAL_EN.3 U$21.A U$22.2(GND) U$23.2(GND) U$24.2(GND) U$25.A U$26.A U$29.A U$32.A U$33.A U$34.A ; also sheet 1,2,3,4,5,6,8,9,10
HALL_FL: HALL_SENSE.1 ; also sheet 9
HALL_FR: HALL_SENSE.3 ; also sheet 9
HALL_RL: HALL_SENSE.2 ; also sheet 9
HALL_RR: HALL_SENSE.4 ; also sheet 9
N$2: R55.2 R56.1 U$21.C
N$20: R49.2 R50.1 U$32.C
N$29: R33.2 R34.1 U$25.C
N$37: R37.2 R38.1 U$26.C
N$38: C29.1 R50.2 U$22.1(+IN)
N$49: R41.2 R42.1 U$29.C
N$52: R51.2 R52.1 U$33.C
N$53: C30.1 R52.2 U$23.1(+IN)
N$59: R35.1 R53.2 R54.1 U$34.C
N$60: C31.1 R54.2 U$24.1(+IN)
PRECHARGE_COMP_F: C32.1 Q7.1(G) R56.2
PRECHARGE_COMPLETE: R55.1 THROTTLE.3
PRECHARGE_COMPLETE_3_3: Q7.3(D) R74.1 ; also sheet 1
PWR [PWR_IN]: PWR.1 ; also sheet 6
RTDS-: DRIVERS.3 ; also sheet 10
THROTTLE_A: R49.1 THROTTLE.1
THROTTLE_A_F: R69.2 U$22.3(-IN) U$22.4(OUT) ; also sheet 9
THROTTLE_A_F_3_3: R69.1 R73.2 ; also sheet 1
THROTTLE_B: R51.1 THROTTLE.2
THROTTLE_B_F: R46.2 U$23.3(-IN) U$23.4(OUT)
THROTTLE_B_F_3_3: R46.1 R72.2 ; also sheet 1
THROTTLE_OUT: THROTTLE.4 ; also sheet 9
TSAL_EN: TSAL_EN.2 ; also sheet 5
TSAL_HV-: DRIVERS.4 ; also sheet 5
TSAL_LV-: DRIVERS.2 ; also sheet 5

## Sheet 8 of 10: Enable
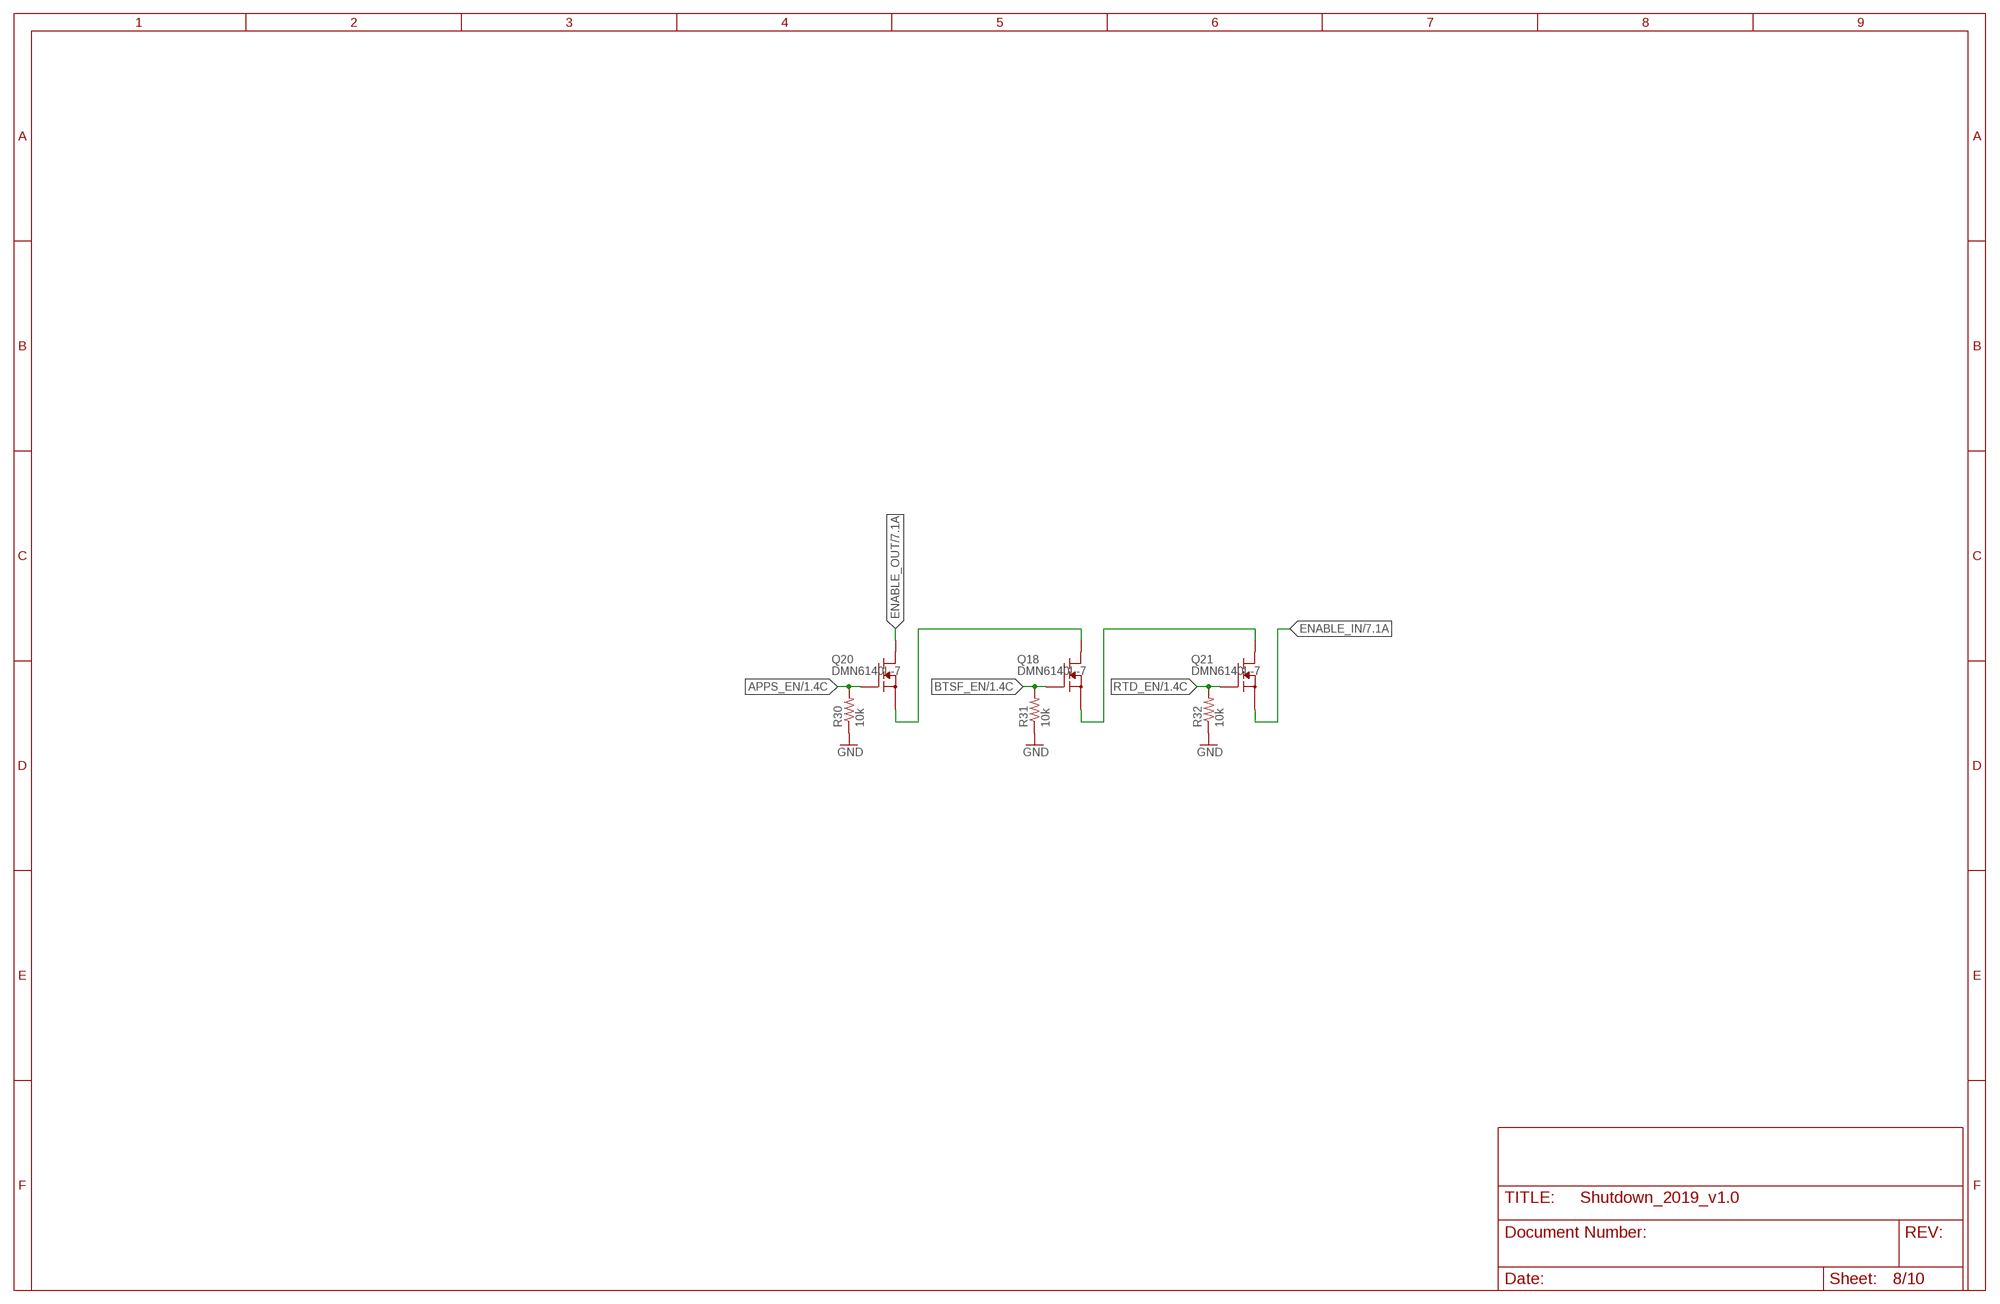
[diagram p7: schematic, sheet 8]

### Parts
Q18  DMN6140L-7  [SOT23]
Q20  DMN6140L-7  [SOT23]
Q21  DMN6140L-7  [SOT23]
R30  10k  R-US_R0603  [R0603]
R31  10k  R-US_R0603  [R0603]
R32  10k  R-US_R0603  [R0603]

### Nets
APPS_EN: Q20.1(G) R30.2 ; also sheet 1
BTSF_EN: Q18.1(G) R31.2 ; also sheet 1
ENABLE_IN: Q21.2(S) ; also sheet 7
ENABLE_OUT: Q20.3(D) ; also sheet 7
GND: R30.1 R31.1 R32.1 ; also sheet 1,2,3,4,5,6,7,9,10
N$24: Q18.3(D) Q20.2(S)
N$25: Q18.2(S) Q21.3(D)
RTD_EN: Q21.1(G) R32.2 ; also sheet 1

## Sheet 9 of 10: Traction Control
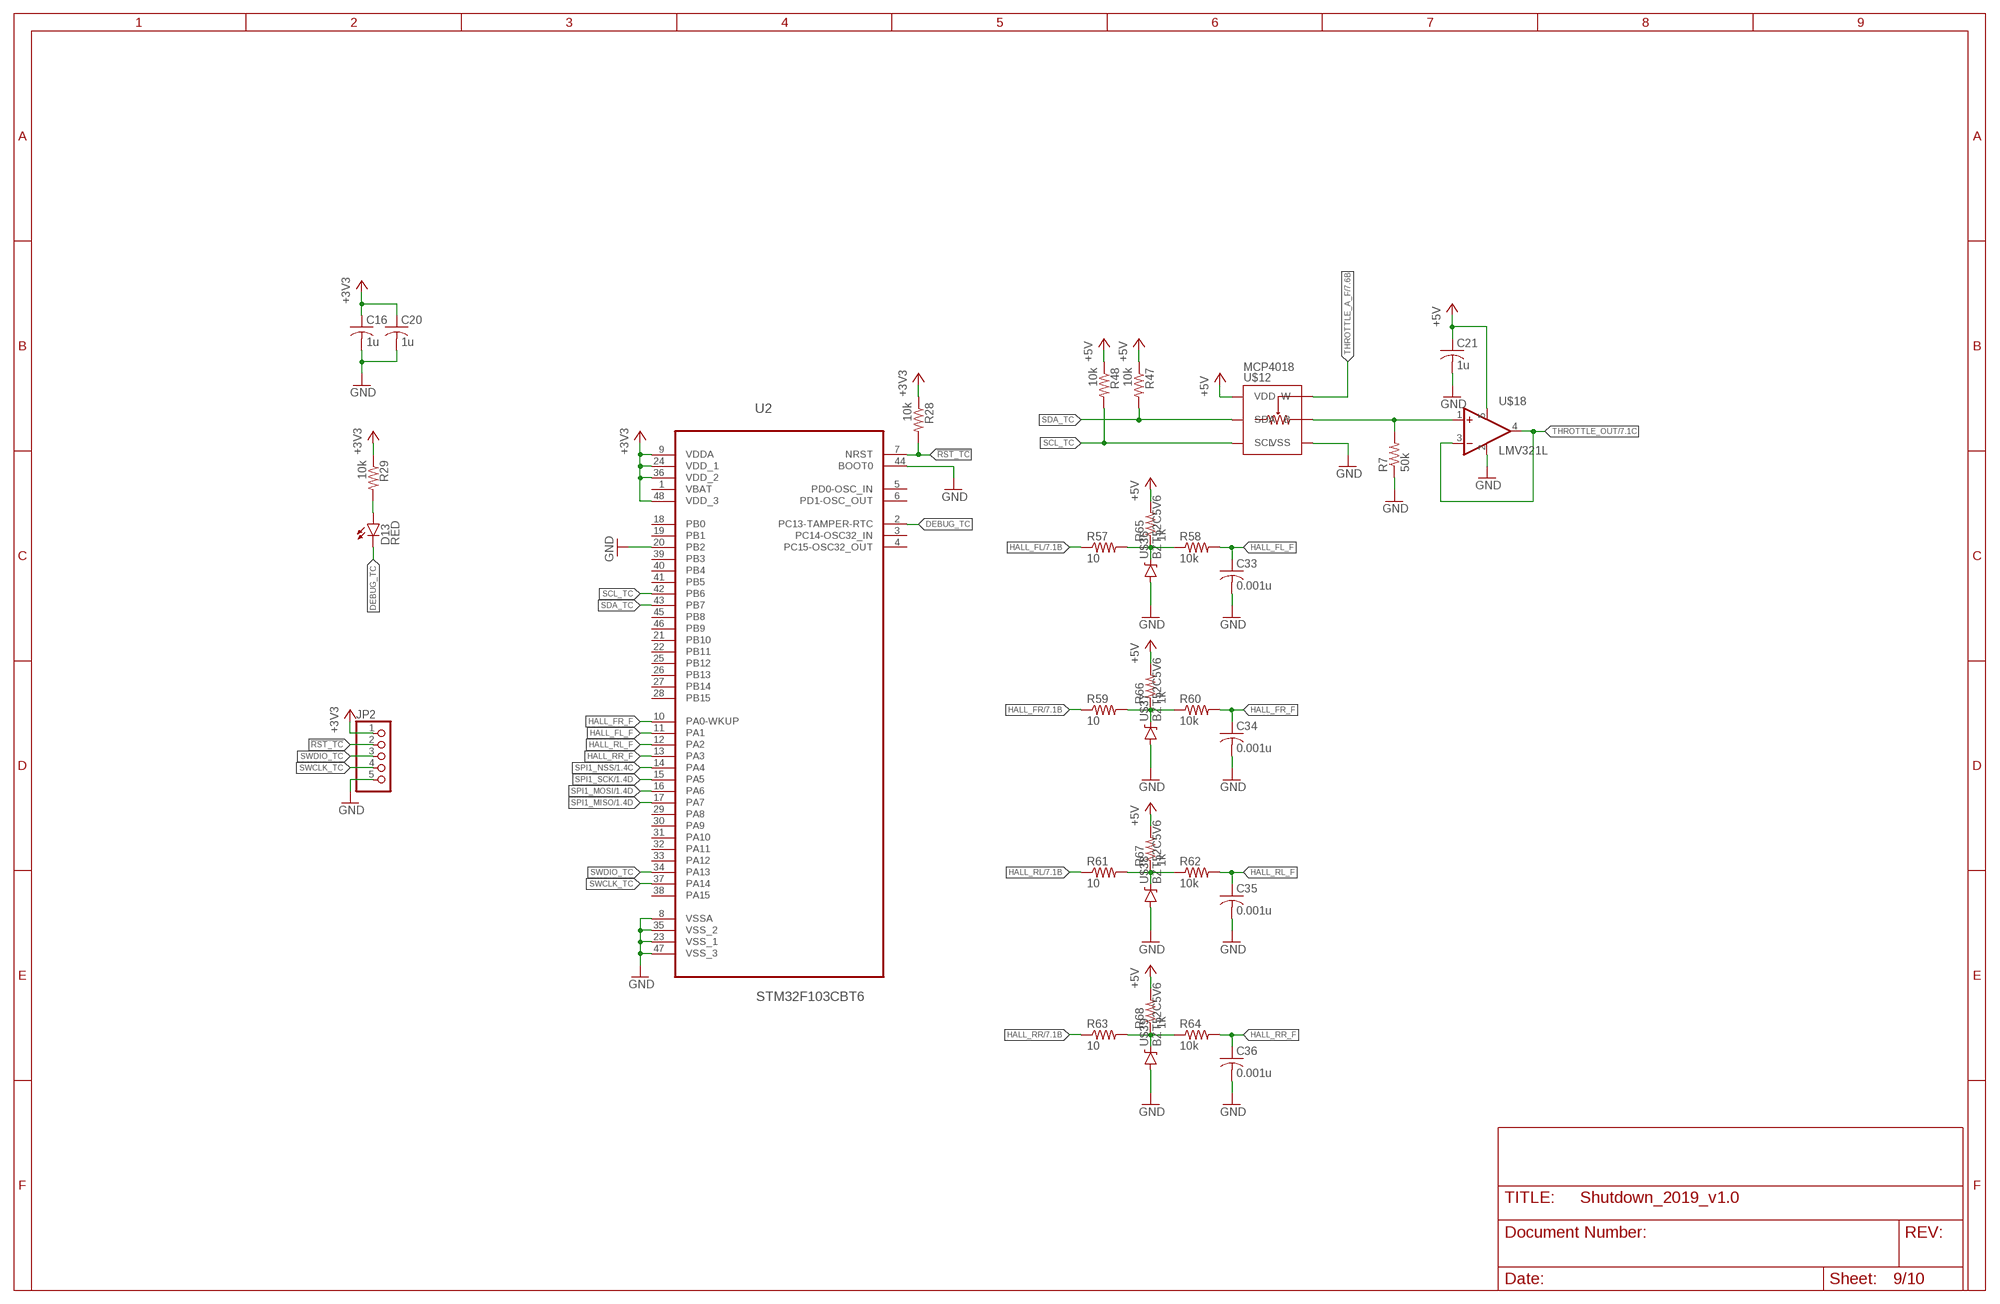
[diagram p8: schematic, sheet 9]

### Parts
C16  1u  C-USC0805  [C0805]
C20  1u  C-USC0805  [C0805]
C21  1u  C-USC0603  [C0603]
C33  0.001u  C-USC0805  [C0805]
C34  0.001u  C-USC0805  [C0805]
C35  0.001u  C-USC0805  [C0805]
C36  0.001u  C-USC0805  [C0805]
D13  RED  LED-RED0603  [LED-0603]
JP2  PINHD-1X5  [1X05]
R7  50k  R-US_R0603  [R0603]
R28  10k  R-US_R0603  [R0603]
R29  10k  R-US_R0603  [R0603]
R47  10k  R-US_R0603  [R0603]
R48  10k  R-US_R0603  [R0603]
R57  10  R-US_R0603  [R0603]
R58  10k  R-US_R0603  [R0603]
R59  10  R-US_R0603  [R0603]
R60  10k  R-US_R0603  [R0603]
R61  10  R-US_R0603  [R0603]
R62  10k  R-US_R0603  [R0603]
R63  10  R-US_R0603  [R0603]
R64  10k  R-US_R0603  [R0603]
R65  1k  R-US_R0603  [R0603]
R66  1k  R-US_R0603  [R0603]
R67  1k  R-US_R0603  [R0603]
R68  1k  R-US_R0603  [R0603]
U2  STM32F103CBT6  [QFP50P900X900X160-48N]
U$12  MCP4018  [SOT23-6]
U$18  LMV321L  [SOT23-5]
U$36  BZT52C5V6  BZT52C  [SOD-123]
U$37  BZT52C5V6  BZT52C  [SOD-123]
U$38  BZT52C5V6  BZT52C  [SOD-123]
U$39  BZT52C5V6  BZT52C  [SOD-123]

### Nets
!RST_TC: JP2.2 R28.2 U2.7(NRST)
+3V3 [PWR]: C16.1 C20.1 JP2.1 R28.1 R29.1 U2.9(VDDA) U2.24(VDD_1) U2.36(VDD_2) U2.48(VDD_3) ; also sheet 1,2,5,6,7
+5V [PWR]: C21.1 R47.1 R48.1 R65.2 R66.2 R67.2 R68.2 U$12.1(VDD) U$18.5(VDD) ; also sheet 1,3,6,7
DEBUG_TC: D13.C U2.2(PC13-TAMPER-RTC)
GND: C16.2 C20.2 C21.2 C33.2 C34.2 C35.2 C36.2 JP2.5 R7.1 U2.8(VSSA) U2.20(PB2) U2.23(VSS_1) U2.35(VSS_2) U2.44(BOOT0) U2.47(VSS_3) U$12.2(VSS) U$18.2(GND) U$36.A U$37.A U$38.A U$39.A ; also sheet 1,2,3,4,5,6,7,8,10
HALL_FL: R57.1 ; also sheet 7
HALL_FL_F: C33.1 R58.2 U2.11(PA1)
HALL_FR: R59.1 ; also sheet 7
HALL_FR_F: C34.1 R60.2 U2.10(PA0-WKUP)
HALL_RL: R61.1 ; also sheet 7
HALL_RL_F: C35.1 R62.2 U2.12(PA2)
HALL_RR: R63.1 ; also sheet 7
HALL_RR_F: C36.1 R64.2 U2.13(PA3)
N$12: R7.2 U$12.5(B) U$18.1(+IN)
N$21: D13.A R29.2
N$65: R57.2 R58.1 R65.1 U$36.C
N$68: R59.2 R60.1 R66.1 U$37.C
N$71: R61.2 R62.1 R67.1 U$38.C
N$74: R63.2 R64.1 R68.1 U$39.C
SCL_TC: R48.2 U2.42(PB6) U$12.3(SCL)
SDA_TC: R47.2 U2.43(PB7) U$12.4(SDA)
SPI1_MISO: U2.17(PA7) ; also sheet 1
SPI1_MOSI: U2.16(PA6) ; also sheet 1
SPI1_NSS: U2.14(PA4) ; also sheet 1
SPI1_SCK: U2.15(PA5) ; also sheet 1
SWCLK_TC: JP2.4 U2.37(PA14)
SWDIO_TC: JP2.3 U2.34(PA13)
THROTTLE_A_F: U$12.6(W) ; also sheet 7
THROTTLE_OUT: U$18.3(-IN) U$18.4(OUT) ; also sheet 7
Unconnected: U2.1(VBAT) U2.3(PC14-OSC32_IN) U2.4(PC15-OSC32_OUT) U2.5(PD0-OSC_IN) U2.6(PD1-OSC_OUT) U2.18(PB0) U2.19(PB1) U2.21(PB10) U2.22(PB11) U2.25(PB12) U2.26(PB13) U2.27(PB14) U2.28(PB15) U2.29(PA8) U2.30(PA9) U2.31(PA10) U2.33(PA12) U2.38(PA15) U2.39(PB3) U2.40(PB4) U2.41(PB5) U2.45(PB8) U2.46(PB9)

## Sheet 10 of 10: Ready To Drive Check
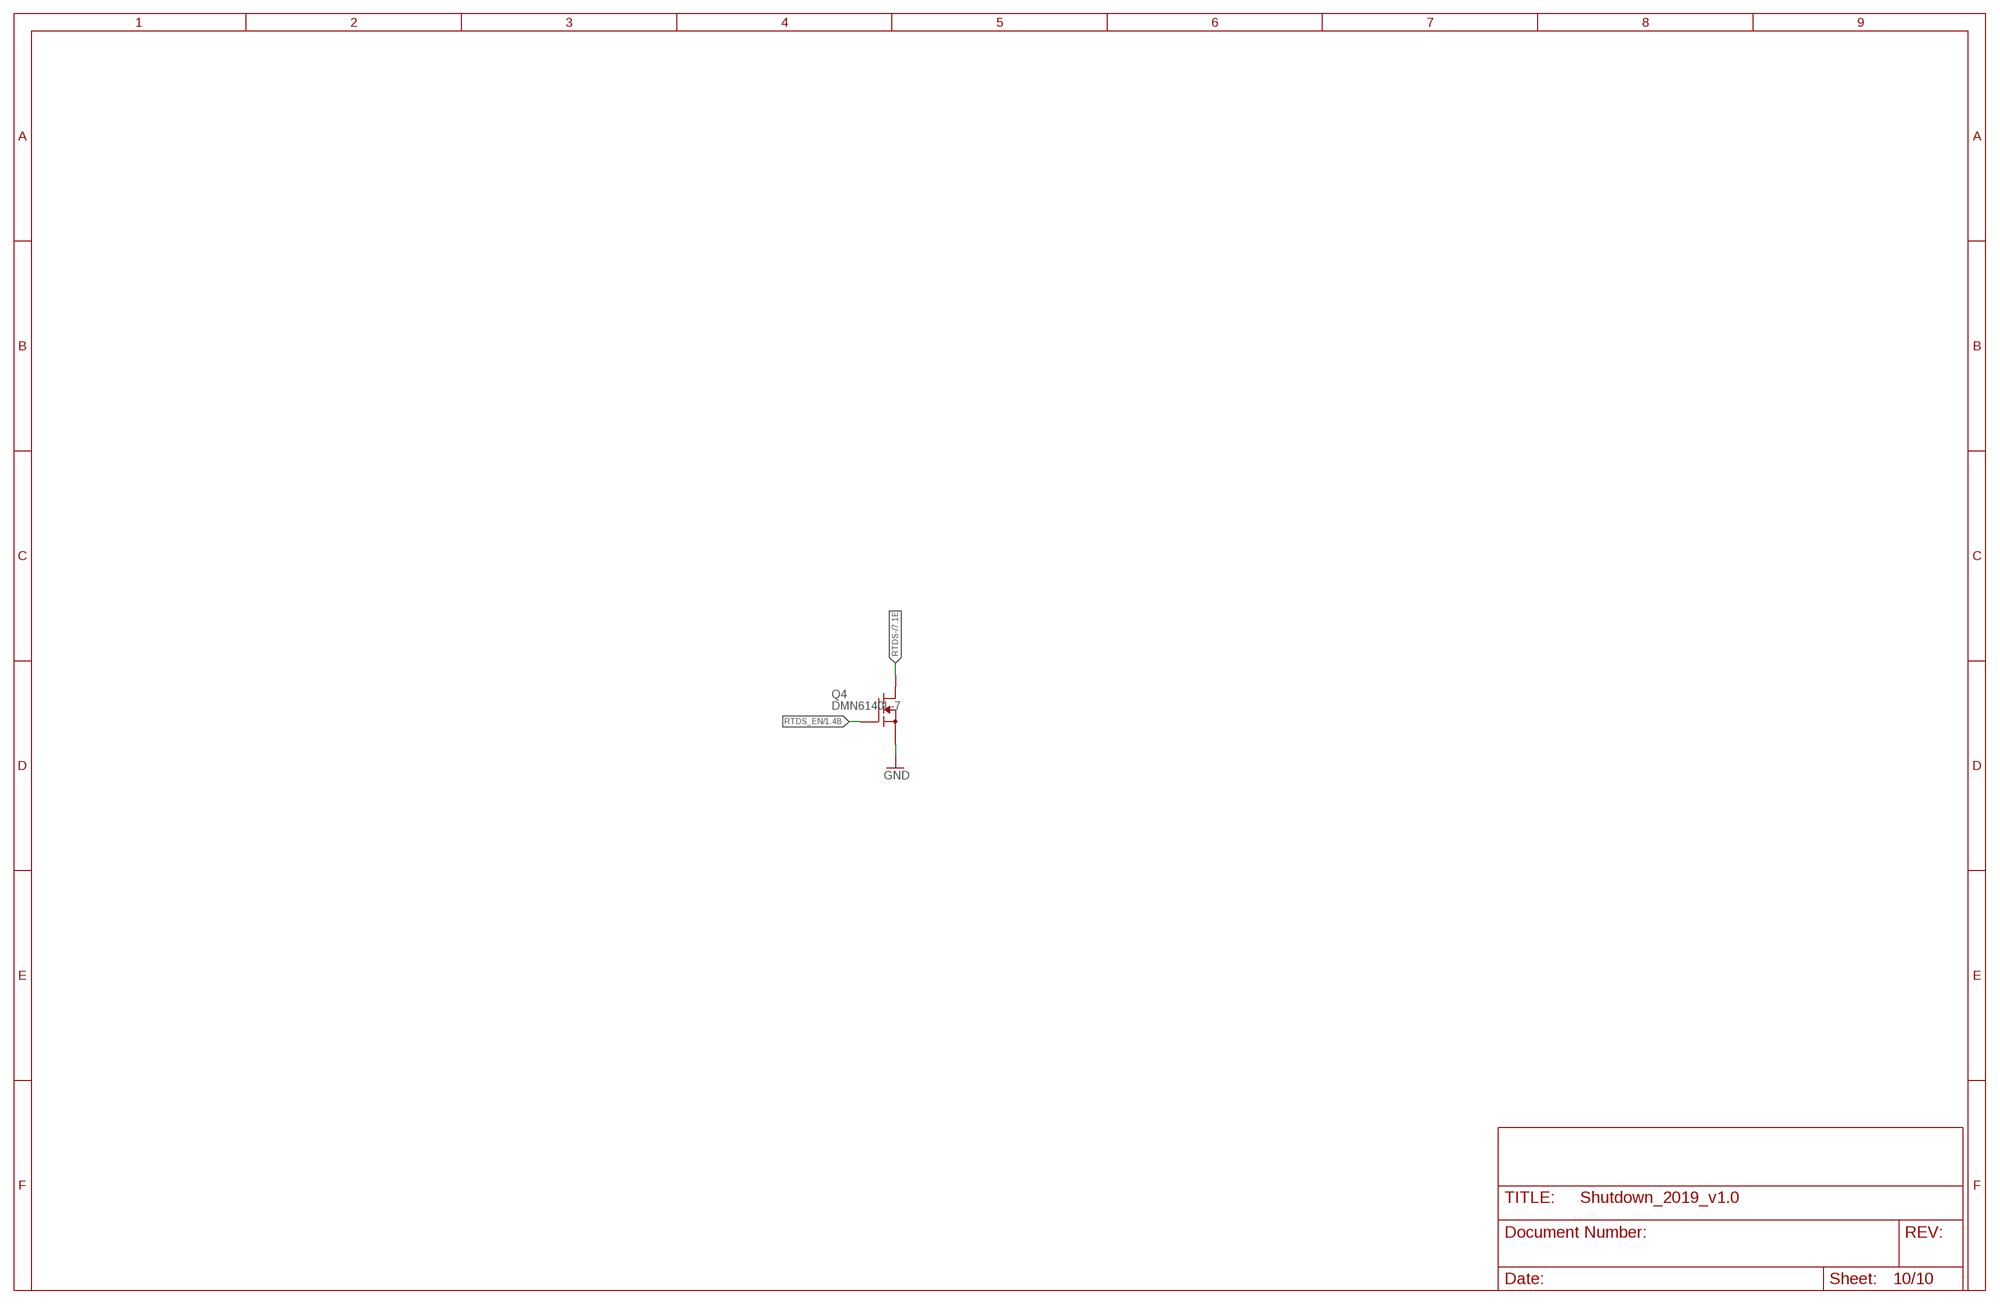
[diagram p9: schematic, sheet 10]

### Parts
Q4  DMN6140L-7  [SOT23]

### Nets
GND: Q4.2(S) ; also sheet 1,2,3,4,5,6,7,8,9
RTDS-: Q4.3(D) ; also sheet 7
RTDS_EN: Q4.1(G) ; also sheet 1

## Power pins joined to a net without a drawn wire
PA11: U2.32(PA11)

## Library data of the parts
AIR CAN CURRENT_SENSOR_SUPPLY ENABLE PWR = Display_Custom:MINIFIT_JR_5566-02: Molex Minifit JR 5566-02 Vertical 2 position headder https://www.molex.com/pdm_docs/sd/039293026_sd.pdf
BRAKE CURR = BOURNS:PV36: BOURNS PV36 Bourns PV36 Potentiometer Datasheet <https://www.bourns.com/docs/Product-Datasheets/pv36.pdf>
BTH1 TTH1 = testpad:TP: Test pad
C1 C3-C7 C24 C25 C27 C28 C37-C39 = resistor:C-US: CAPACITOR, American symbol
C2 C8 C9 C11-C23 C26 C29-C36 = rcl:C-US: CAPACITOR, American symbol; SPICEPREFIX: C
C10 = rcl:CPOL-US: POLARIZED CAPACITOR, American symbol; SPICEPREFIX: C
D1 D4 D7 = SparkFun-LED:LED-BLUE: Blue LEDs for production use Various blue LEDs stocked by SparkFun production 0603 - DIO-08575 Rebel - DIO-09553 1206 - DIO-09911; PROD_ID: DIO-08575
D2 D9 D15 = Diodes:1N914
D8 = diode:PESD1CAN: CAN bus ESD protection diode Source: http://www.nxp.com/documents/data_sheet/PESD1CAN.pdf
D10 D13 = SparkFun-LED:LED-RED: Assorted Red LEDs LilyPad 1206- DIO-09912 1206- DIO-00809 0603- DIO-00819 "SMART" means more efficient and expensive; PROD_ID: DIO-00819
D11 D12 = SparkFun-LED:LED-GREEN: Various green LEDs Green LEDs used in SFE Production 0603- DIO-00821 LARGE- DIO-00862 LILYPAD- DIO-09910; PROD_ID: DIO-00821
DRIVERS FAULT_INPUT HALL_SENSE THROTTLE TSAL_EN = Display_Custom:MINIFIT_JR_5566-04: Molex Minifit JR 5566-04 Vertical 4 position headder https://www.molex.com/pdm_docs/sd/039293026_sd.pdf
FUSE = Fuse:MINI297-3568
H1-H4 = holes:MOUNT-PAD-ROUND: MOUNTING PAD, round
JP1 JP2 = Headers_IFE:PINHD-1X5: PIN HEADER
L4 = microbuilder:INDUCTOR: Inductors 0603: 10nH Ceramic Inductor - microwire antenna/RF (Digikey: 712-1434-2-ND) 0805: 560nH Ceramic Inductor - RF (Digikey: 553-1047-1-ND) 270nH Ceramic Inductor - Q = 40@250MHz, +-5%, 1 Ohm DC Resistance (Digikey: 535-10506-2-ND) 1007 (2518 Metric) SMT: 10µH 10% 250mOhm 820mA 1007 Inductor (Digikey: 587-2189-1-ND) 22µH 10% 500mOhm 580mA 1007 Inductor (Digikey: 587-2190-1-ND) 47µH 10% 950mOhm 420mA 1007 Inductor (Digikey: 587-2191-1-ND) 47µH 5% 100mOhm 1A 1008 Inductor (Digikey: 732-1816-1-ND) 5.0x5.0mm (Taiyo Yuden NR5040 Series) 6.8µH 20% 2.3A 64mOhm Inductor (Digikey: 587-2374-2-ND) 5.0x5.0mm (TDK VLC5045 Series) 4.7µH 20% 3.3A 34mOhm Inductor (Digikey: 445-6526-1-ND) 6.8µH 20% 2.7A 46mOhm Inductor (Digikey: 445-6527-1-ND) 6.0x6.0mm (TDK VLC6045 Series) 4.7µH 20% 3.8A 27mOhm Inductor (Digikey: 445-6538-2-ND) 6.8µH 20% 3A 41mOhm Inductor (Digikey: 445-6540-1-ND) 6.2µH 30% 2.2A 45mOhm Inductor (Digikey: SRR5028-6R2YCT-ND) - Not TDK VLC6045 but footprint should match 6.0x6.0mm (TDK SLF6045 Series) 6.8uH 30% 2A 33mOhm Inductor (Digikey: 445-4572-1-ND, Mouser: 810-SLF645T6R8N2R0PF) 6.0x6.0mm (Sumida CDRH5D28 Series) 6.2uH 30% 1.8A 45mOhm Inductor (Digikey: 308-1542-1-ND) Taiyo Yuden NR3015T2R2M - 2.2uH 20% 1.5A (Digikey: 587-1648-2-ND, Mouser: 963-NR3015T2R2M) - Used with TI TPS62172 CoilCraft RFID Transponder Coil - MA5532-AE (For use with AS3935 Lightning Sensor)
Q1-Q5 Q7 Q9 Q10 Q16 Q18 Q20 Q21 = TRANS:DMN6140L-7: DMN6140L-7 Vgs(th) = 3V, Rds(on) = 140mOhm, Vds(max) = 60V
Q6 Q11 Q15 = TRANS:DMP3099L-7: DMP3099L-7 P-Channel Vgs(th) = 2.1V, Rds(on) = 64 mohm, Vds(max) = 30V
Q12-Q14 Q17 = TRANS:IRLML6346PBF: IRLML6346TRPBF Vgs(th) = 1.1V, Rds(on) = 63 mOhm, Vds(max) = 30V
R1 R5 R8 R11-R18 R21-R23 R25 R36 R39 R40 R43 R44 = resistor:R-US_: RESISTOR, American symbol
R2-R4 R6 R7 R9 R19 R20 R24 R26-R35 R37 R38 R41 R42 R46-R74 = rcl:R-US_: RESISTOR, American symbol; SPICEPREFIX: R
U1 U2 = ST Microelctronics_By_element14_Batch_1:STM32F103CBT6: Medium-density performance line ARM-based 32-bit MCU; MPN: STM32F103CBT6; OC_FARNELL: 1606327; OC_NEWARK: 11N8296; PACKAGE: QFP-48; SUPPLIER: STMICROELECTRONICS
U$4 U$7 U$8 = DIODES_INC:DNBT8105: DNBT8105 Diodes Inc 1A NPN SURFACE MOUNT TRANSISTOR Vce = 60V, Ice = 1A, h=100, Vbe = 1.1V https://www.diodes.com/assets/Datasheets/ds30513.pdf
U$5 U$16 U$17 U$20 = STM:TS881: STM TS881 Single rail to rail comparator with push pull output. Datasheet <https://www.st.com/content/ccc/resource/technical/document/datasheet/a2/60/3e/5d/b2/c1/4a/e9/DM00057901.pdf/files/DM00057901.pdf/jcr:content/translations/en.DM00057901.pdf>
U$9 = MAXLINEAR:SPX1117M3-L-3-3: SPX1117M3-L-3-3 3.3V 800mA LDO MaxLinear Inc Datasheet <https://www.exar.com/ds/spx1117_ds_r210_082411.pdf> Digikey <https://www.digikey.com/product-detail/en/maxlinear-inc/SPX1117M3-L-3-3-TR/1016-1848-1-ND/3586565>
U$10 = MAXLINEAR:SPX1117M3-L-5-0: SPX1117M3-L-5-0 5.0V 800mA LDO MaxLinear Inc Datasheet <https://www.exar.com/ds/spx1117_ds_r210_082411.pdf> Digikey <https://www.digikey.com/product-detail/en/maxlinear-inc/SPX1117M3-L-3-3-TR/1016-1848-1-ND/3586565>
U$11 = MICROCHIP:MCP2562: MCP2562 High Speed CAN Tranceiver The MCP2561/2 is Microchip Technology Inc. second generation high-speed CAN transceiver. It serves as an interface between a CAN protocol controller and the physical two-wire CAN bus. The device meets the automotive requirements for high-speed (1 Mb/s), low quiescent current, electromagnetic compatibility (EMC) and electrostatic discharge (ESD). The device family members are: • MCP2561 with SPLIT pin • MCP2562 with VIO pin Datasheet <http://ww1.microchip.com/downloads/en/DeviceDoc/20005167C.pdf> Microchip <https://www.microchip.com/wwwproducts/en/MCP2562> Digikey <https://www.digikey.com/product-detail/en/microchip-technology/MCP2562T-E-SN/MCP2562T-E-SNCT-ND/5011025>
U$12 = MICROCHIP:MCP4018: MICROCHIP MCP4018 7-Bit Single I2C™ Digital POT with Volatile Memory in SC70 Datasheet <http://ww1.microchip.com/downloads/en/DeviceDoc/22147a.pdf>
U$13-U$15 = KEMET:EC2: KEMET EC2 DPDT General Purpose 2A Relay. 12V coil voltage. Datasheet <https://content.kemet.com/datasheets/KEM_R7002_EC2_EE2.pdf> Digikey <https://www.digikey.com/product-detail/en/kemet/EC2-12TNU/399-11031-5-ND/4291097>
U$18 U$22-U$24 = STM:LMV321L: STM LMV321L Rail to Rail General Purpose Op-Amp Datasheet <https://www.st.com/content/ccc/resource/technical/document/datasheet/fa/2c/e4/1d/5f/74/45/2a/DM00052423.pdf/files/DM00052423.pdf/jcr:content/translations/en.DM00052423.pdf>
U$21 U$25 U$26 U$29 U$32-U$34 U$36-U$39 = DIODES_INC:BZT52C: DIODES INC BZT52C Small form factor Zener Diode Datasheet <https://www.diodes.com/assets/Datasheets/ds18004.pdf>

## Net classes
0 default: width 0.254 mm
1 PWR: width 0.254 mm
2 AIR: width 1.27 mm
3 PWR_IN: width 0.406 mm